# EAGLE schematic STM32F446 front pane - v3 (EAGLE 9.6.2), part 1 of 2

## Sheet 1 of 8
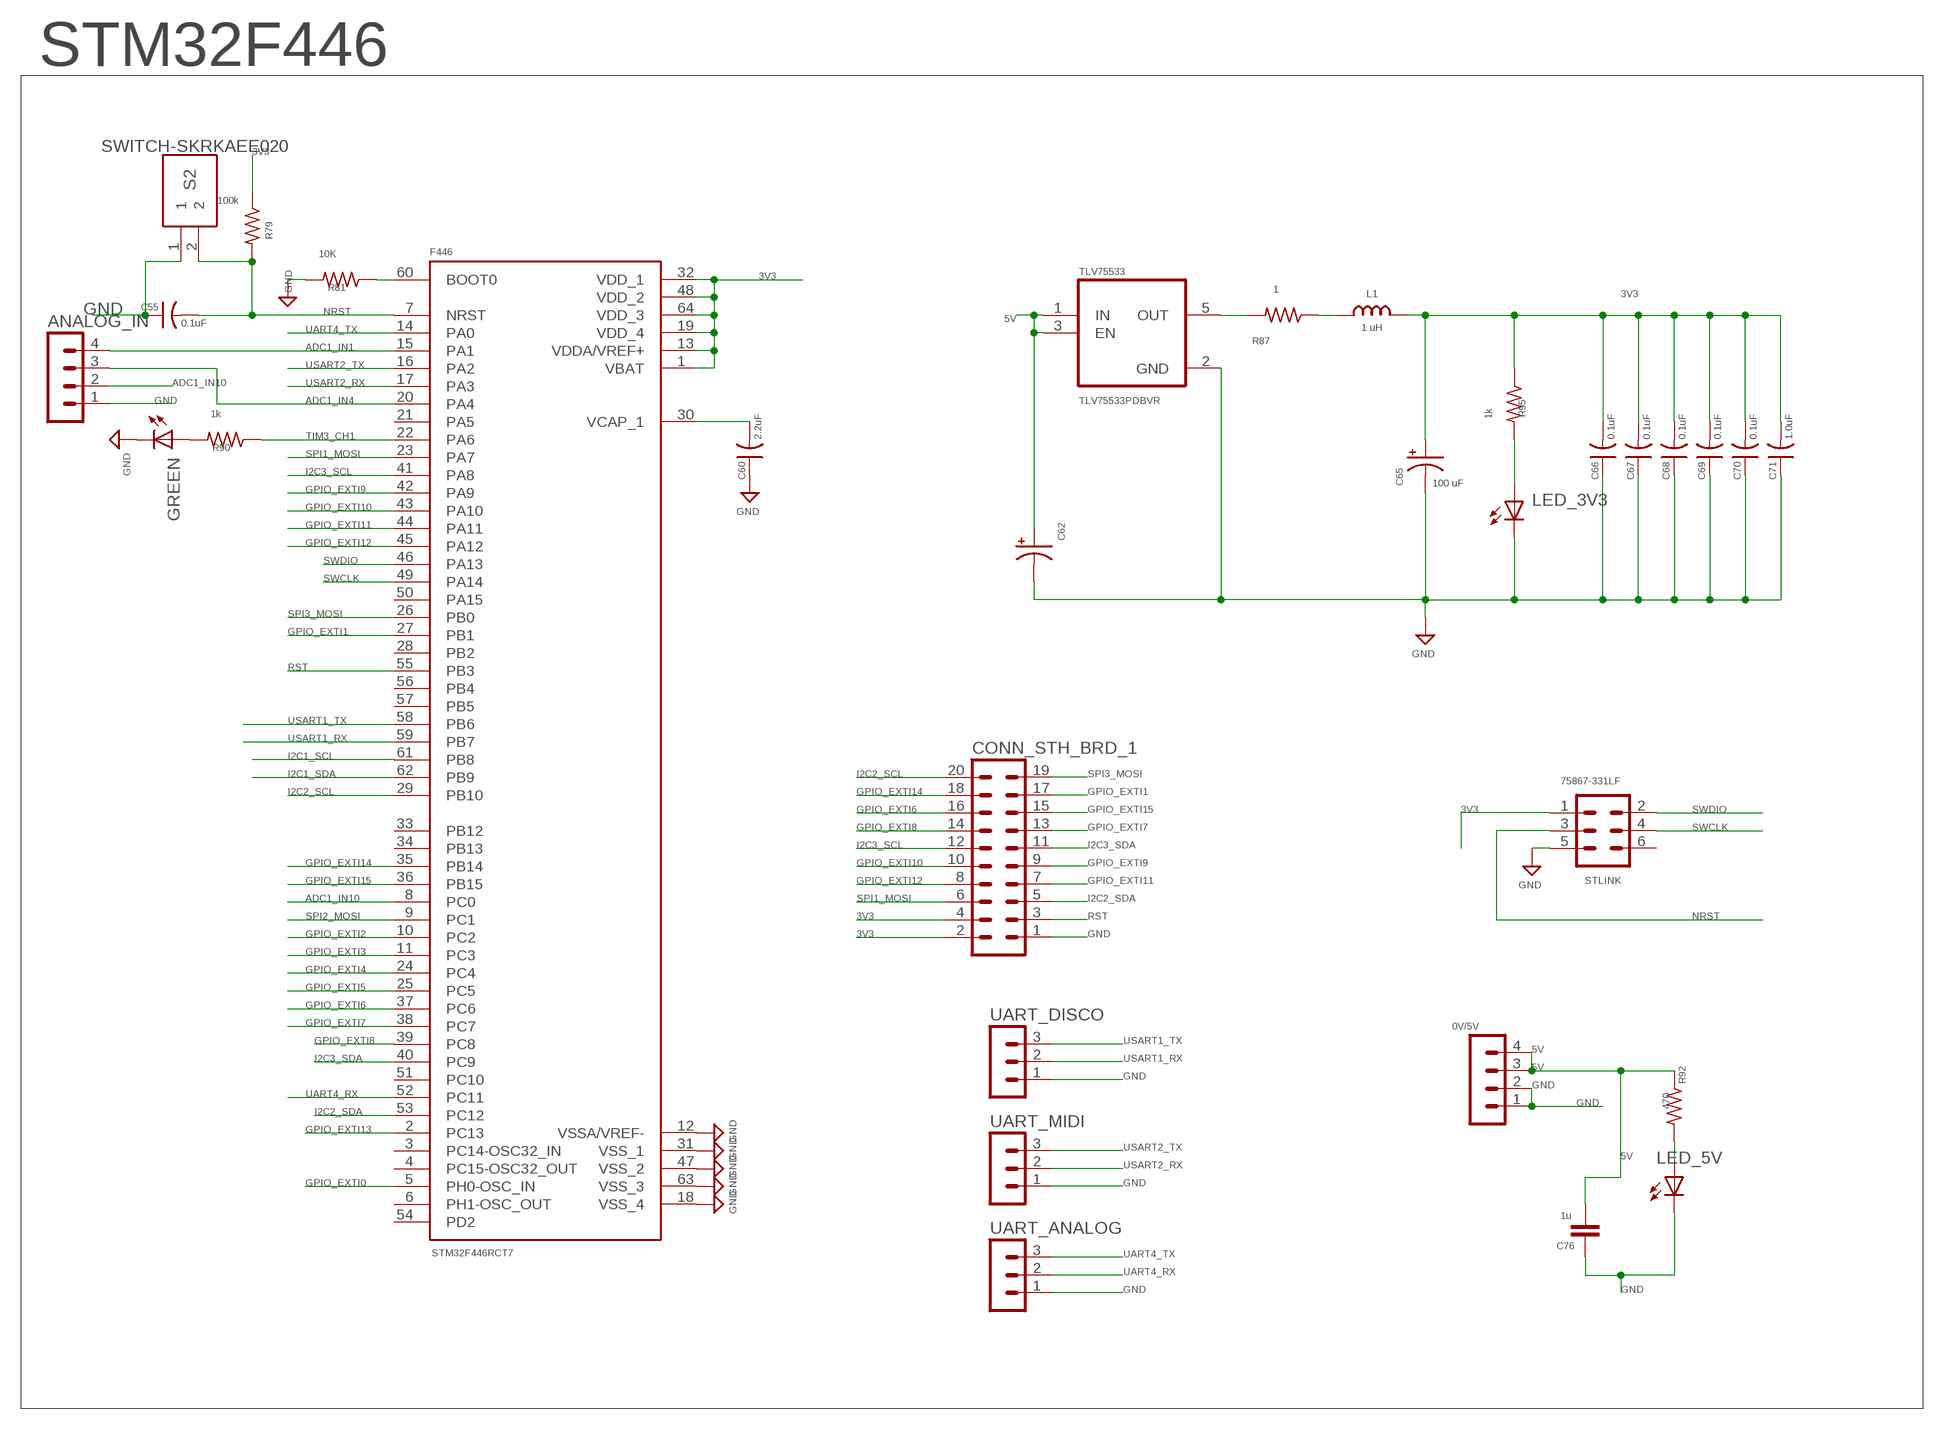
[diagram p0: schematic, sheet 1]

### Parts
0V/5V  PINHEADER-M04PL  [MA04-1]
ANALOG_IN  MA04-1  [MA04-1]
C55  0.1uF  C-US0805  [C0805]
C60  2.2uF  C-US0805  [C0805]
C62  10u  CPOL-US2917  [CPOL2917]
C65  100 uF  CPOL-US2917  [CPOL2917]
C66  0.1uF  C-US0805  [C0805]
C67  0.1uF  C-US0805  [C0805]
C68  0.1uF  C-US0805  [C0805]
C69  0.1uF  C-US0805  [C0805]
C70  0.1uF  C-US0805  [C0805]
C71  1.0uF  C-US0805  [C0805]
C76  1u  C-EUC1206  [C1206]
CONN_STH_BRD_1  MA10-2  [MA10-2]
F446  STM32F446RCT7  [QFP50P1200X1200X160-64N]
GREEN  LED-0805  [0805-LED]
L1  1 uH  L-USL0805  [L0805]
LED_3V3  LED-0805  [0805-LED]
LED_5V  LED-0603  [0603-LED]
R79  100k  R-US0805  [R0805]
R81  10K  R-US0805  [R0805]
R87  1  R-US0805  [R0805]
R90  1k  R-US0805  [R0805]
R92  470  R-US0805  [R0805]
R95  1k  R-US0805  [R0805]
S2  SWITCH-SKRKAEE020  [SKRKAEE020]
STLINK  75867-331LF  MA03-2  [MA03-2]
TLV75533  TLV75533PDBVR  [SOT95P280X145-5N]
UART_ANALOG  MA03-1  [MA03-1]
UART_DISCO  MA03-1  [MA03-1]
UART_MIDI  MA03-1  [MA03-1]

### Nets
3V3: C65.+ C66.2 C67.2 C68.2 C69.2 C70.2 C71.2 CONN_STH_BRD_1.2 CONN_STH_BRD_1.4 F446.1(VBAT) F446.13(VDDA/VREF+) F446.19(VDD_4) F446.32(VDD_1) F446.48(VDD_2) F446.64(VDD_3) L1.2 R79.1 R95.1 STLINK.1 ; also sheet 2,3,4,5,6,7
5V: 0V/5V.3 0V/5V.4 C62.+ C76.2 R92.1 TLV75533.1(IN) TLV75533.3(EN)
ADC1_IN1: ANALOG_IN.4 F446.15(PA1)
ADC1_IN4: ANALOG_IN.3 F446.20(PA4)
ADC1_IN10: ANALOG_IN.2 F446.8(PC0)
BOOT1: F446.60(BOOT0) R81.1
GND: 0V/5V.1 0V/5V.2 ANALOG_IN.1 C55.1 C60.1 C62.- C65.- C66.1 C67.1 C68.1 C69.1 C70.1 C71.1 C76.1 CONN_STH_BRD_1.1 F446.12(VSSA/VREF-) F446.18(VSS_4) F446.31(VSS_1) F446.47(VSS_2) F446.63(VSS_3) GREEN.C LED_3V3.C LED_5V.C R81.2 S2.1 STLINK.5 TLV75533.2(GND) UART_ANALOG.1 UART_DISCO.1 UART_MIDI.1 ; also sheet 2,3,4,5,6,7
GPIO_EXTI0: F446.5(PH0-OSC_IN) ; also sheet 6
GPIO_EXTI1: CONN_STH_BRD_1.17 F446.27(PB1)
GPIO_EXTI2: F446.10(PC2) ; also sheet 6
GPIO_EXTI3: F446.11(PC3) ; also sheet 6
GPIO_EXTI4: F446.24(PC4) ; also sheet 5
GPIO_EXTI5: F446.25(PC5) ; also sheet 5
GPIO_EXTI6: CONN_STH_BRD_1.16 F446.37(PC6)
GPIO_EXTI7: CONN_STH_BRD_1.13 F446.38(PC7)
GPIO_EXTI8: CONN_STH_BRD_1.14 F446.39(PC8)
GPIO_EXTI9: CONN_STH_BRD_1.9 F446.42(PA9)
GPIO_EXTI10: CONN_STH_BRD_1.10 F446.43(PA10)
GPIO_EXTI11: CONN_STH_BRD_1.7 F446.44(PA11)
GPIO_EXTI12: CONN_STH_BRD_1.8 F446.45(PA12)
GPIO_EXTI13: F446.2(PC13) ; also sheet 6
GPIO_EXTI14: CONN_STH_BRD_1.18 F446.35(PB14)
GPIO_EXTI15: CONN_STH_BRD_1.15 F446.36(PB15)
I2C1_SCL: F446.61(PB8) ; also sheet 5,6
I2C1_SDA: F446.62(PB9) ; also sheet 5,6
I2C2_SCL: CONN_STH_BRD_1.20 F446.29(PB10) ; also sheet 2,3,4
I2C2_SDA: CONN_STH_BRD_1.5 F446.53(PC12) ; also sheet 2,3,4
I2C3_SCL: CONN_STH_BRD_1.12 F446.41(PA8) ; also sheet 2
I2C3_SDA: CONN_STH_BRD_1.11 F446.40(PC9) ; also sheet 2
N$53: LED_5V.A R92.2
N$56: GREEN.A R90.2
N$57: LED_3V3.A R95.2
N$108: R87.2 TLV75533.5(OUT)
N$109: L1.1 R87.1
NRST: C55.2 F446.7(NRST) R79.2 S2.2 STLINK.3
RST: CONN_STH_BRD_1.3 F446.55(PB3) ; also sheet 2,3,4,5,6
SPI1_MOSI: CONN_STH_BRD_1.6 F446.23(PA7) ; also sheet 2,3
SPI2_MOSI: F446.9(PC1) ; also sheet 5
SPI3_MOSI: CONN_STH_BRD_1.19 F446.26(PB0) ; also sheet 2,4
SWCLK: F446.49(PA14) STLINK.4
SWDIO: F446.46(PA13) STLINK.2
TIM3_CH1: F446.22(PA6) R90.1
UART4_RX: F446.52(PC11) UART_ANALOG.2
UART4_TX: F446.14(PA0) UART_ANALOG.3
USART1_RX: F446.59(PB7) UART_DISCO.2
USART1_TX: F446.58(PB6) UART_DISCO.3
USART2_RX: F446.17(PA3) UART_MIDI.2
USART2_TX: F446.16(PA2) UART_MIDI.3
VCAP1: C60.2 F446.30(VCAP_1)
Unconnected: F446.3(PC14-OSC32_IN) F446.4(PC15-OSC32_OUT) F446.6(PH1-OSC_OUT) F446.21(PA5) F446.28(PB2) F446.33(PB12) F446.34(PB13) F446.50(PA15) F446.51(PC10) F446.54(PD2) F446.56(PB4) F446.57(PB5) STLINK.6

### Notes on the sheet
- STM32F446

## Sheet 2 of 8
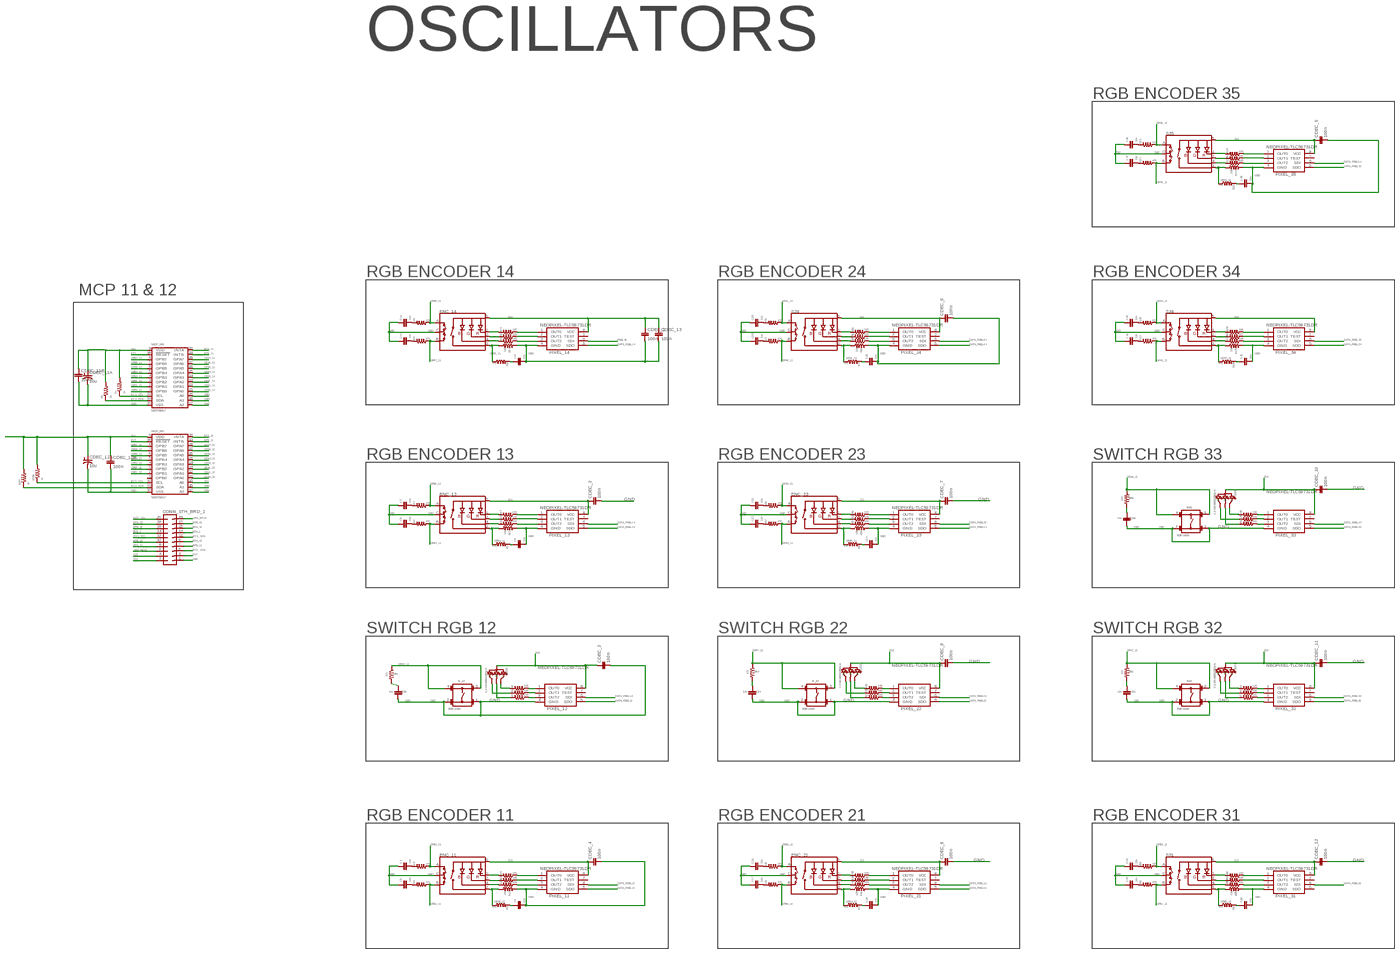
[diagram p1: schematic, sheet 2, overview]
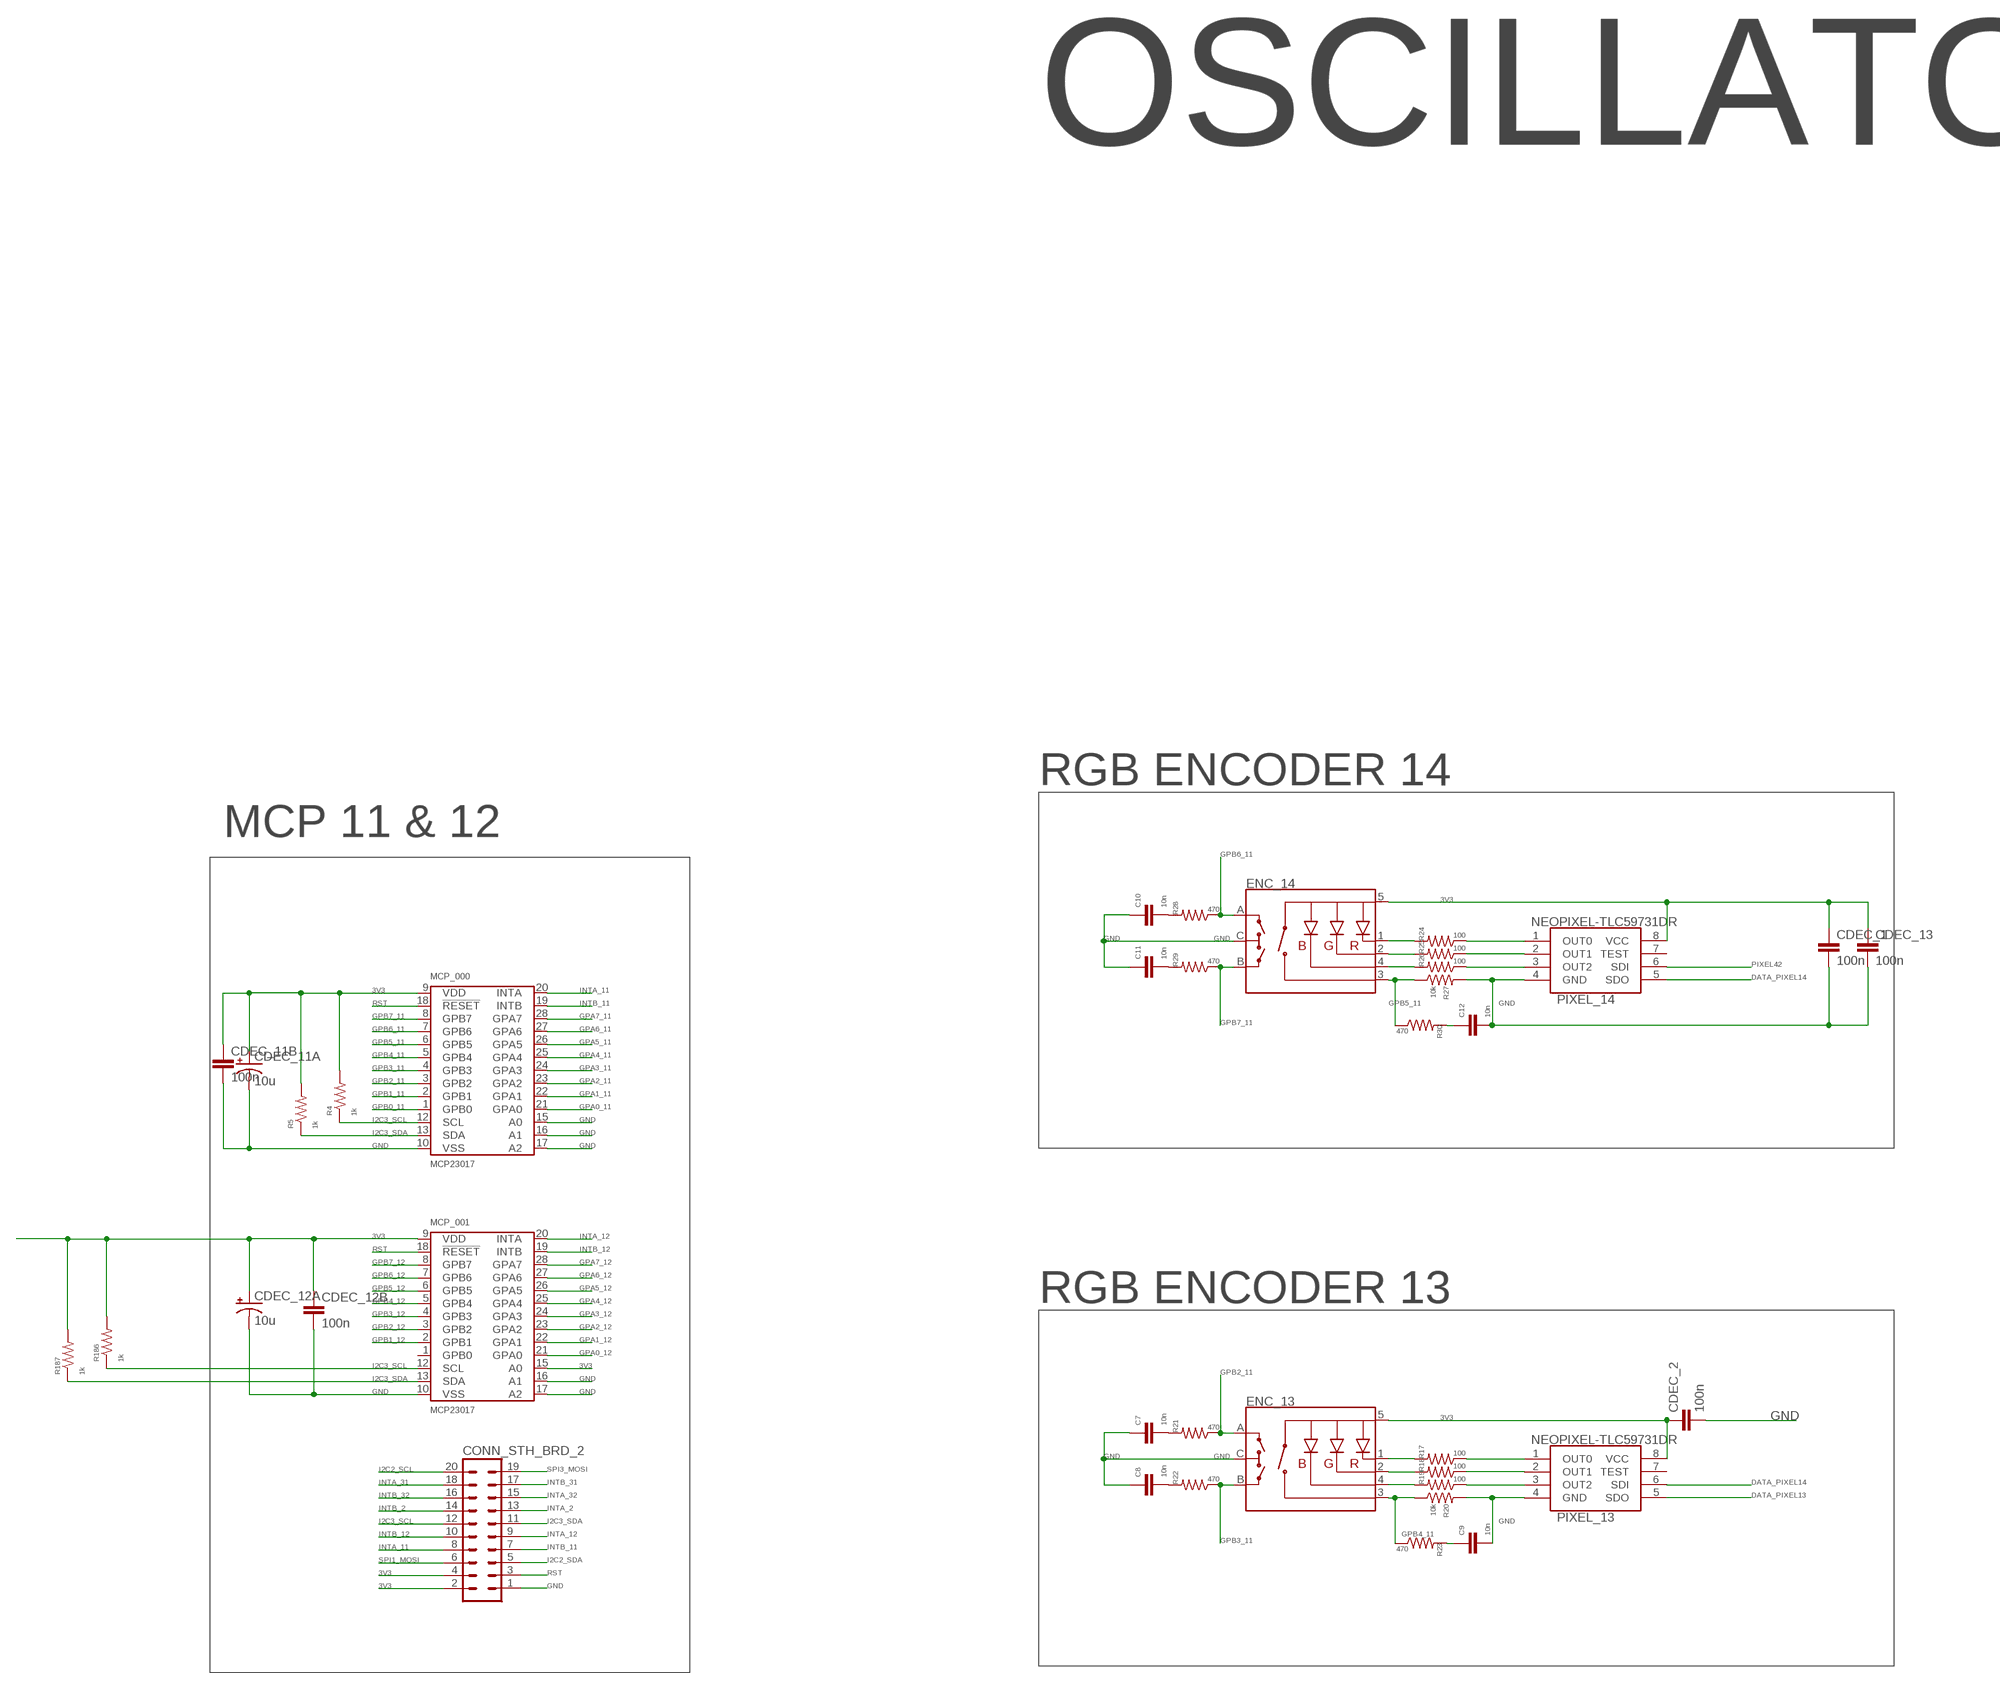
[diagram p2: schematic, sheet 2, part 1 of 4]
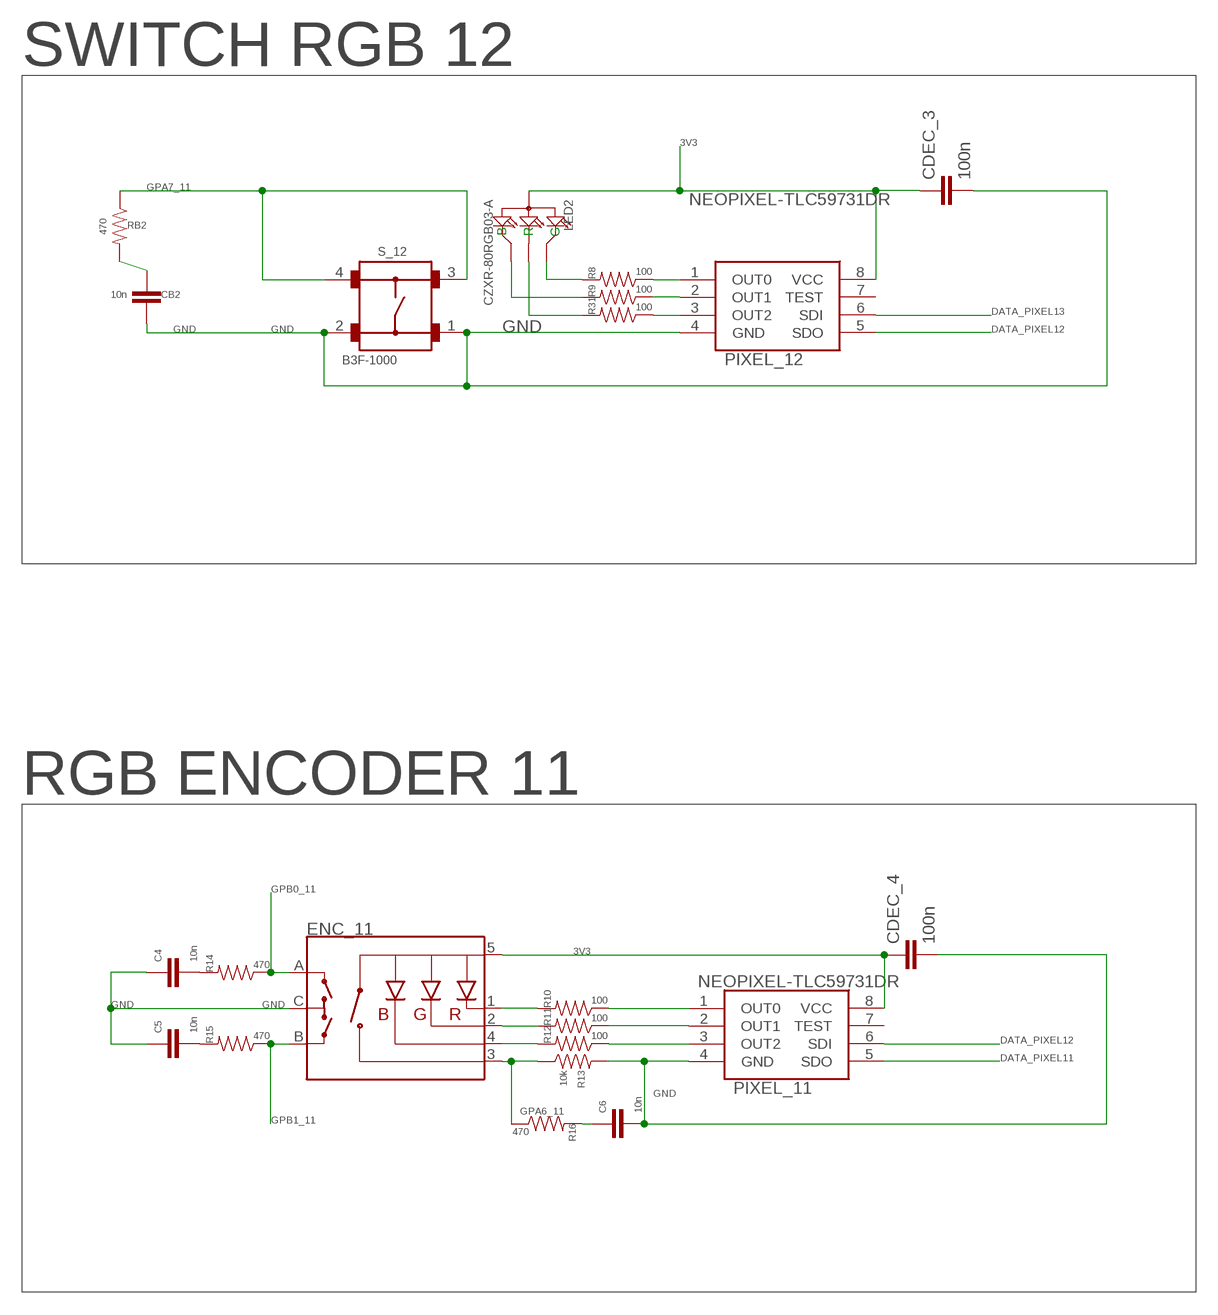
[diagram p3: schematic, sheet 2, part 2 of 4]
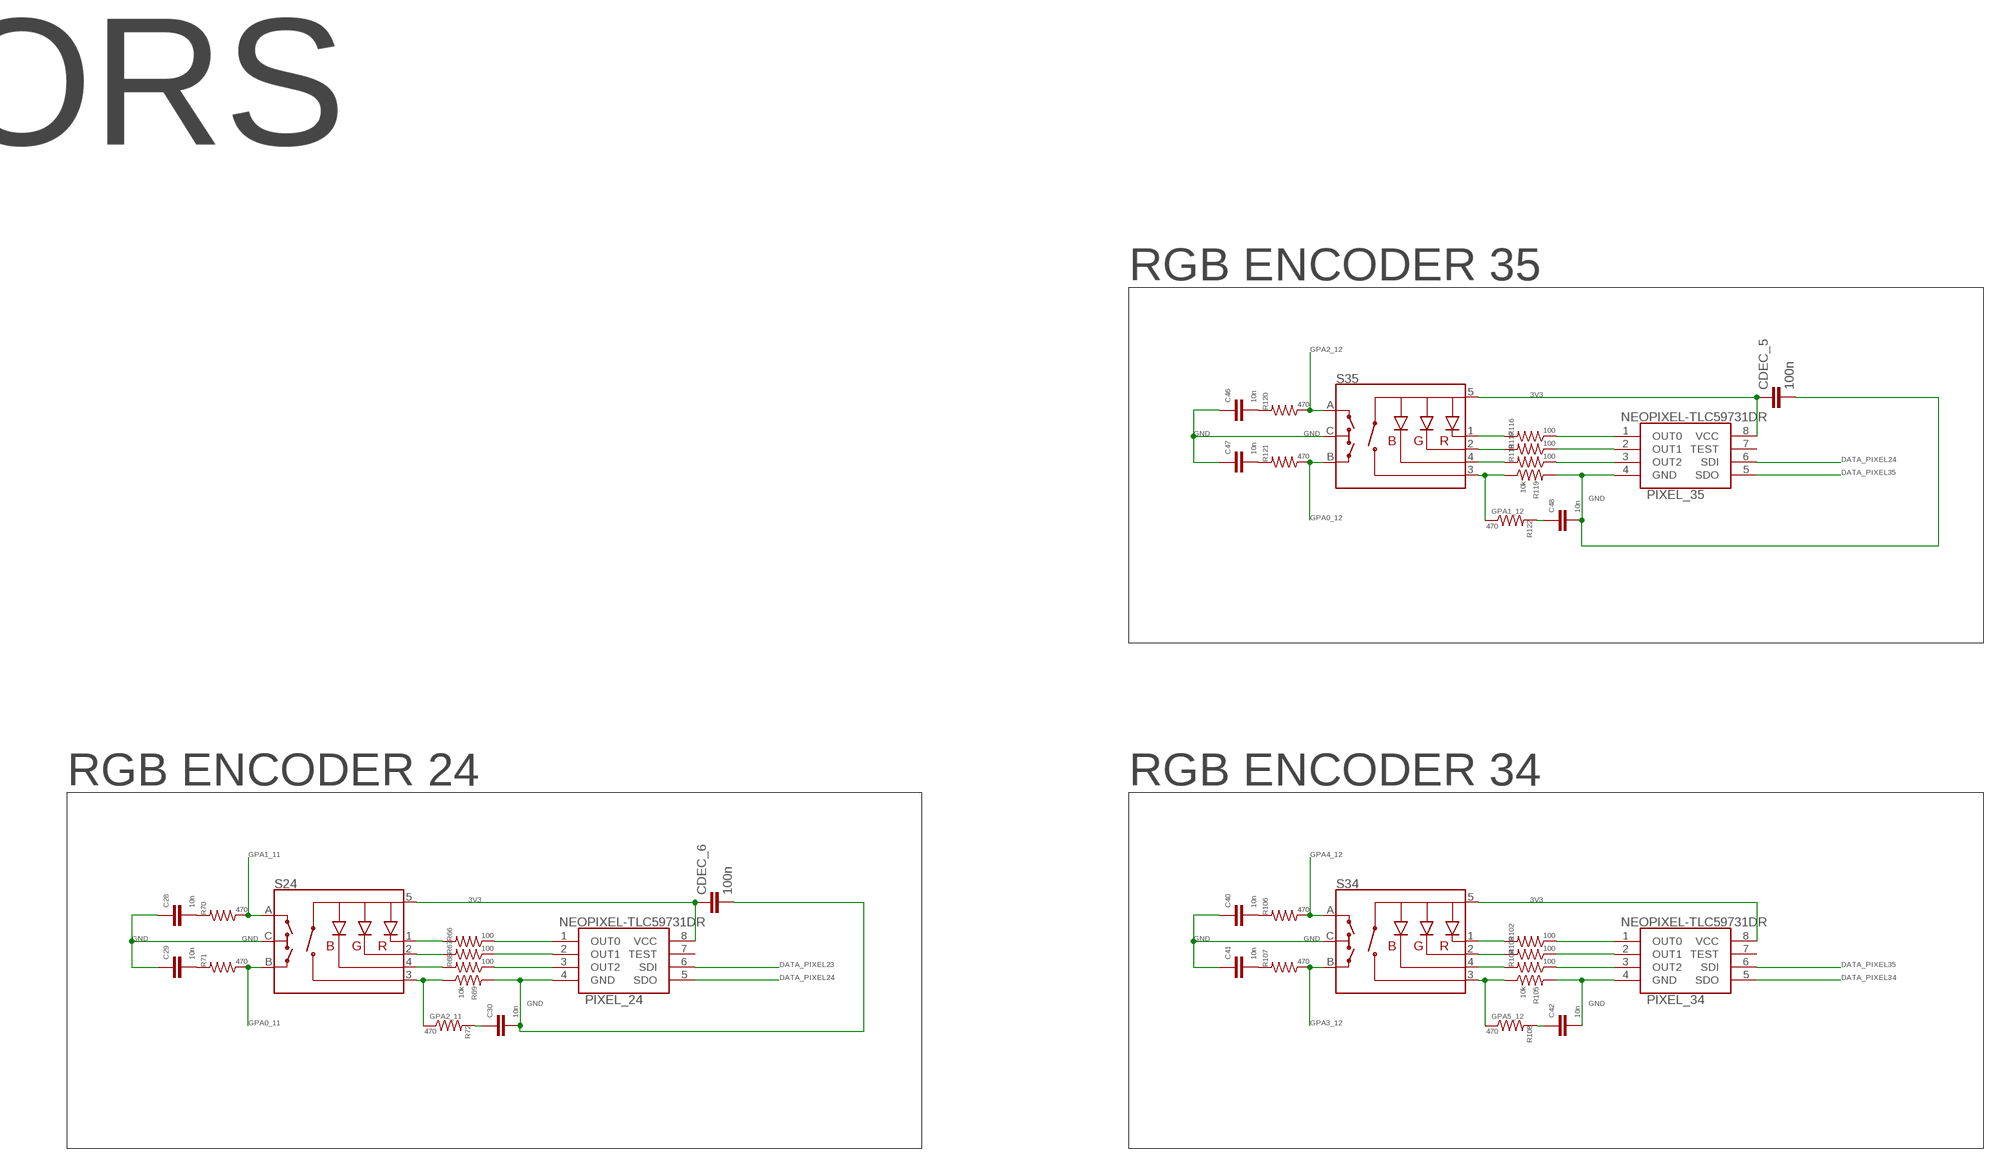
[diagram p4: schematic, sheet 2, part 3 of 4]
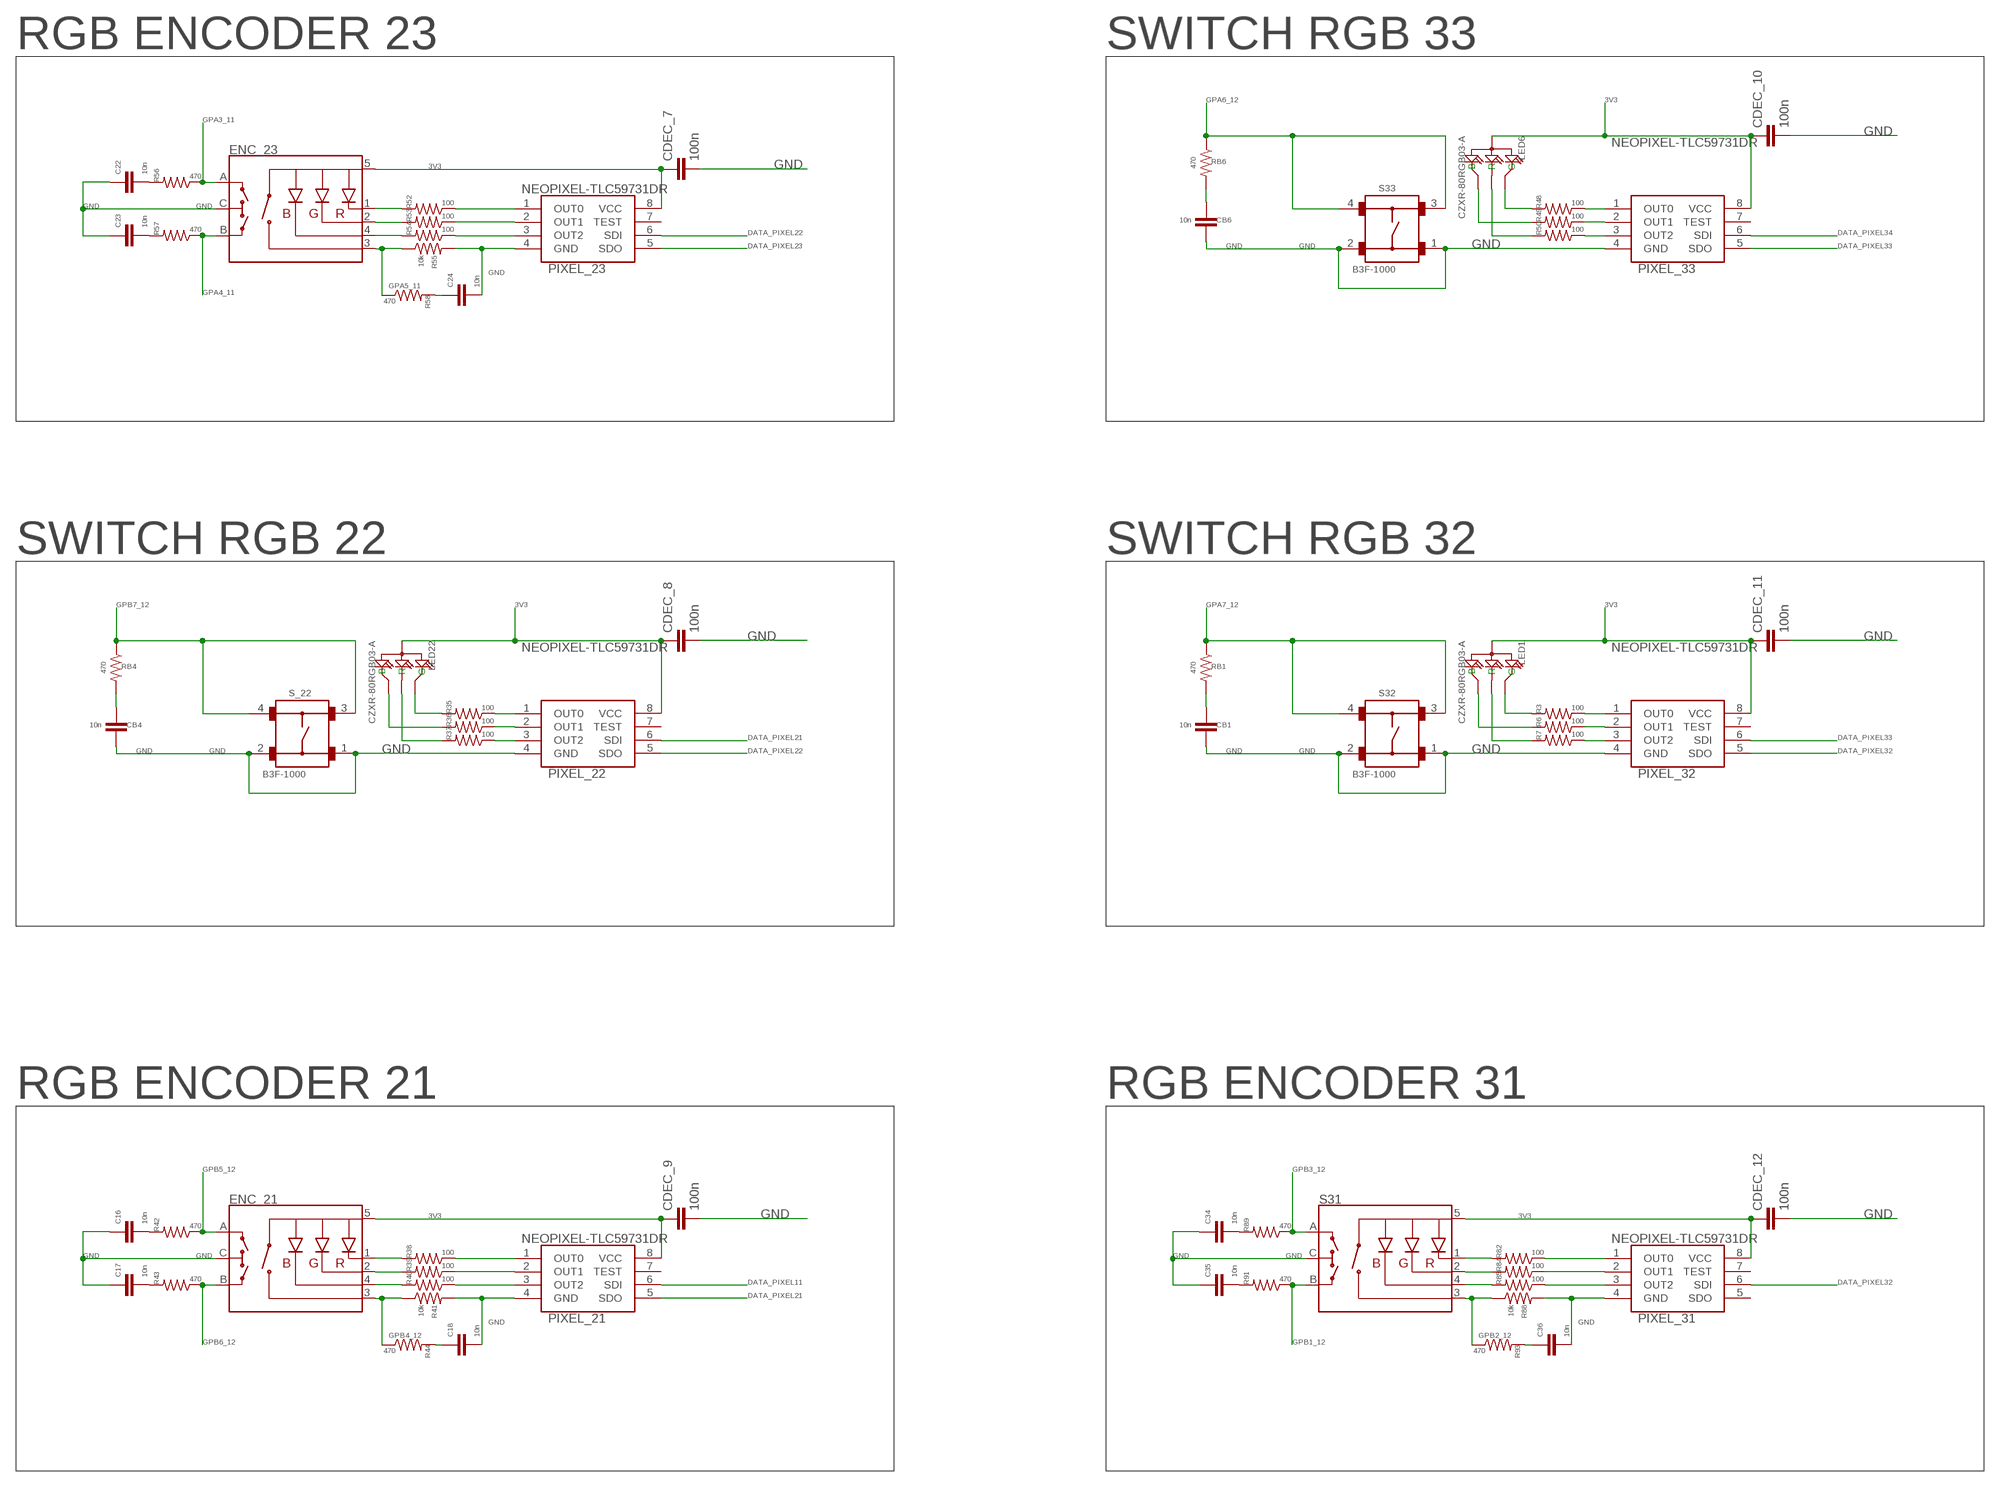
[diagram p5: schematic, sheet 2, part 4 of 4]

### Parts
C4  10n  PASSIF-CAP-0805  [0805-CAP]
C5  10n  PASSIF-CAP-0805  [0805-CAP]
C6  10n  PASSIF-CAP-0805  [0805-CAP]
C7  10n  PASSIF-CAP-0805  [0805-CAP]
C8  10n  PASSIF-CAP-0805  [0805-CAP]
C9  10n  PASSIF-CAP-0805  [0805-CAP]
C10  10n  PASSIF-CAP-0805  [0805-CAP]
C11  10n  PASSIF-CAP-0805  [0805-CAP]
C12  10n  PASSIF-CAP-0805  [0805-CAP]
C16  10n  PASSIF-CAP-0805  [0805-CAP]
C17  10n  PASSIF-CAP-0805  [0805-CAP]
C18  10n  PASSIF-CAP-0805  [0805-CAP]
C22  10n  PASSIF-CAP-0805  [0805-CAP]
C23  10n  PASSIF-CAP-0805  [0805-CAP]
C24  10n  PASSIF-CAP-0805  [0805-CAP]
C28  10n  PASSIF-CAP-0805  [0805-CAP]
C29  10n  PASSIF-CAP-0805  [0805-CAP]
C30  10n  PASSIF-CAP-0805  [0805-CAP]
C34  10n  PASSIF-CAP-0805  [0805-CAP]
C35  10n  PASSIF-CAP-0805  [0805-CAP]
C36  10n  PASSIF-CAP-0805  [0805-CAP]
C40  10n  PASSIF-CAP-0805  [0805-CAP]
C41  10n  PASSIF-CAP-0805  [0805-CAP]
C42  10n  PASSIF-CAP-0805  [0805-CAP]
C46  10n  PASSIF-CAP-0805  [0805-CAP]
C47  10n  PASSIF-CAP-0805  [0805-CAP]
C48  10n  PASSIF-CAP-0805  [0805-CAP]
CB1  10n  PASSIF-CAP-0805  [0805-CAP]
CB2  10n  PASSIF-CAP-0805  [0805-CAP]
CB4  10n  PASSIF-CAP-0805  [0805-CAP]
CB6  10n  PASSIF-CAP-0805  [0805-CAP]
CDEC_1  100n  PASSIF-CAP-1206  [1206]
CDEC_2  100n  PASSIF-CAP-1206  [1206]
CDEC_3  100n  PASSIF-CAP-1206  [1206]
CDEC_4  100n  PASSIF-CAP-1206  [1206]
CDEC_5  100n  PASSIF-CAP-1206  [1206]
CDEC_6  100n  PASSIF-CAP-1206  [1206]
CDEC_7  100n  PASSIF-CAP-1206  [1206]
CDEC_8  100n  PASSIF-CAP-1206  [1206]
CDEC_9  100n  PASSIF-CAP-1206  [1206]
CDEC_10  100n  PASSIF-CAP-1206  [1206]
CDEC_11  100n  PASSIF-CAP-1206  [1206]
CDEC_11A  10u  PASSIF-CPOL-US2917  [CPOL2917]
CDEC_11B  100n  PASSIF-CAP-0805  [0805-CAP]
CDEC_12  100n  PASSIF-CAP-1206  [1206]
CDEC_12A  10u  PASSIF-CPOL-US2917  [CPOL2917]
CDEC_12B  100n  PASSIF-CAP-0805  [0805-CAP]
CDEC_13  100n  PASSIF-CAP-1206  [1206]
CONN_STH_BRD_2  MA10-2  [MA10-2]
ENC_11  ENCODER-RGB-SWITCH-NO_NUT  [ENCODER_LED_3]
ENC_13  ENCODER-RGB-SWITCH-NO_NUT  [ENCODER_LED_3]
ENC_14  ENCODER-RGB-SWITCH-NO_NUT  [ENCODER_LED_3]
ENC_21  ENCODER-RGB-SWITCH-NO_NUT  [ENCODER_LED_3]
ENC_23  ENCODER-RGB-SWITCH-NO_NUT  [ENCODER_LED_3]
LED1  CZXR-80RGB03-A  DIP-LED-RGB-COMMON-ANODE(4P-D8MM)  [LED4-2.0-D8.0MM]
LED2  CZXR-80RGB03-A  DIP-LED-RGB-COMMON-ANODE(4P-D8MM)  [LED4-2.0-D8.0MM]
LED6  CZXR-80RGB03-A  DIP-LED-RGB-COMMON-ANODE(4P-D8MM)  [LED4-2.0-D8.0MM]
LED22  CZXR-80RGB03-A  DIP-LED-RGB-COMMON-ANODE(4P-D8MM)  [LED4-2.0-D8.0MM]
MCP_000  MCP23017  [SOIC-28]
MCP_001  MCP23017  [SOIC-28]
PIXEL_11  NEOPIXEL-TLC59731DR  [SOIC127P600X175-8N]
PIXEL_12  NEOPIXEL-TLC59731DR  [SOIC127P600X175-8N]
PIXEL_13  NEOPIXEL-TLC59731DR  [SOIC127P600X175-8N]
PIXEL_14  NEOPIXEL-TLC59731DR  [SOIC127P600X175-8N]
PIXEL_21  NEOPIXEL-TLC59731DR  [SOIC127P600X175-8N]
PIXEL_22  NEOPIXEL-TLC59731DR  [SOIC127P600X175-8N]
PIXEL_23  NEOPIXEL-TLC59731DR  [SOIC127P600X175-8N]
PIXEL_24  NEOPIXEL-TLC59731DR  [SOIC127P600X175-8N]
PIXEL_31  NEOPIXEL-TLC59731DR  [SOIC127P600X175-8N]
PIXEL_32  NEOPIXEL-TLC59731DR  [SOIC127P600X175-8N]
PIXEL_33  NEOPIXEL-TLC59731DR  [SOIC127P600X175-8N]
PIXEL_34  NEOPIXEL-TLC59731DR  [SOIC127P600X175-8N]
PIXEL_35  NEOPIXEL-TLC59731DR  [SOIC127P600X175-8N]
R3  100  PASSIF-RESISTOR-1206  [1206]
R4  1k  R-US_R0805  [R0805]
R5  1k  R-US_R0805  [R0805]
R6  100  PASSIF-RESISTOR-1206  [1206]
R7  100  PASSIF-RESISTOR-1206  [1206]
R8  100  PASSIF-RESISTOR-1206  [1206]
R9  100  PASSIF-RESISTOR-1206  [1206]
R10  100  PASSIF-RESISTOR-1206  [1206]
R11  100  PASSIF-RESISTOR-1206  [1206]
R12  100  PASSIF-RESISTOR-1206  [1206]
R13  10k  PASSIF-RESISTOR-1206  [1206]
R14  470  PASSIF-RESISTOR-1206  [1206]
R15  470  PASSIF-RESISTOR-1206  [1206]
R16  470  PASSIF-RESISTOR-1206  [1206]
R17  100  PASSIF-RESISTOR-1206  [1206]
R18  100  PASSIF-RESISTOR-1206  [1206]
R19  100  PASSIF-RESISTOR-1206  [1206]
R20  10k  PASSIF-RESISTOR-1206  [1206]
R21  470  PASSIF-RESISTOR-1206  [1206]
R22  470  PASSIF-RESISTOR-1206  [1206]
R23  470  PASSIF-RESISTOR-1206  [1206]
R24  100  PASSIF-RESISTOR-1206  [1206]
R25  100  PASSIF-RESISTOR-1206  [1206]
R26  100  PASSIF-RESISTOR-1206  [1206]
R27  10k  PASSIF-RESISTOR-1206  [1206]
R28  470  PASSIF-RESISTOR-1206  [1206]
R29  470  PASSIF-RESISTOR-1206  [1206]
R30  470  PASSIF-RESISTOR-1206  [1206]
R31  100  PASSIF-RESISTOR-1206  [1206]
R35  100  PASSIF-RESISTOR-1206  [1206]
R36  100  PASSIF-RESISTOR-1206  [1206]
R37  100  PASSIF-RESISTOR-1206  [1206]
R38  100  PASSIF-RESISTOR-1206  [1206]
R39  100  PASSIF-RESISTOR-1206  [1206]
R40  100  PASSIF-RESISTOR-1206  [1206]
R41  10k  PASSIF-RESISTOR-1206  [1206]
R42  470  PASSIF-RESISTOR-1206  [1206]
R43  470  PASSIF-RESISTOR-1206  [1206]
R44  470  PASSIF-RESISTOR-1206  [1206]
R48  100  PASSIF-RESISTOR-1206  [1206]
R49  100  PASSIF-RESISTOR-1206  [1206]
R50  100  PASSIF-RESISTOR-1206  [1206]
R52  100  PASSIF-RESISTOR-1206  [1206]
R53  100  PASSIF-RESISTOR-1206  [1206]
R54  100  PASSIF-RESISTOR-1206  [1206]
R55  10k  PASSIF-RESISTOR-1206  [1206]
R56  470  PASSIF-RESISTOR-1206  [1206]
R57  470  PASSIF-RESISTOR-1206  [1206]
R58  470  PASSIF-RESISTOR-1206  [1206]
R66  100  PASSIF-RESISTOR-1206  [1206]
R67  100  PASSIF-RESISTOR-1206  [1206]
R68  100  PASSIF-RESISTOR-1206  [1206]
R69  10k  PASSIF-RESISTOR-1206  [1206]
R70  470  PASSIF-RESISTOR-1206  [1206]
R71  470  PASSIF-RESISTOR-1206  [1206]
R72  470  PASSIF-RESISTOR-1206  [1206]
R82  100  PASSIF-RESISTOR-1206  [1206]
R84  100  PASSIF-RESISTOR-1206  [1206]
R85  100  PASSIF-RESISTOR-1206  [1206]
R88  10k  PASSIF-RESISTOR-1206  [1206]
R89  470  PASSIF-RESISTOR-1206  [1206]
R91  470  PASSIF-RESISTOR-1206  [1206]
R93  470  PASSIF-RESISTOR-1206  [1206]
R102  100  PASSIF-RESISTOR-1206  [1206]
R103  100  PASSIF-RESISTOR-1206  [1206]
R104  100  PASSIF-RESISTOR-1206  [1206]
R105  10k  PASSIF-RESISTOR-1206  [1206]
R106  470  PASSIF-RESISTOR-1206  [1206]
R107  470  PASSIF-RESISTOR-1206  [1206]
R108  470  PASSIF-RESISTOR-1206  [1206]
R116  100  PASSIF-RESISTOR-1206  [1206]
R117  100  PASSIF-RESISTOR-1206  [1206]
R118  100  PASSIF-RESISTOR-1206  [1206]
R119  10k  PASSIF-RESISTOR-1206  [1206]
R120  470  PASSIF-RESISTOR-1206  [1206]
R121  470  PASSIF-RESISTOR-1206  [1206]
R122  470  PASSIF-RESISTOR-1206  [1206]
R186  1k  R-US_R0805  [R0805]
R187  1k  R-US_R0805  [R0805]
RB1  470  PASSIF-RESISTOR-1206  [1206]
RB2  470  PASSIF-RESISTOR-1206  [1206]
RB4  470  PASSIF-RESISTOR-1206  [1206]
RB6  470  PASSIF-RESISTOR-1206  [1206]
S24  ENCODER-RGB-SWITCH-NO_NUT  [ENCODER_LED_3]
S31  ENCODER-RGB-SWITCH-NO_NUT  [ENCODER_LED_3]
S32  B3F-1000  [B3F-1000]
S33  B3F-1000  [B3F-1000]
S34  ENCODER-RGB-SWITCH-NO_NUT  [ENCODER_LED_3]
S35  ENCODER-RGB-SWITCH-NO_NUT  [ENCODER_LED_3]
S_12  B3F-1000  [B3F-1000]
S_22  B3F-1000  [B3F-1000]

### Nets
3V3: CDEC_1.1 CDEC_2.1 CDEC_3.1 CDEC_4.1 CDEC_5.1 CDEC_6.1 CDEC_7.1 CDEC_8.1 CDEC_9.1 CDEC_10.1 CDEC_11.1 CDEC_11A.+ CDEC_11B.1 CDEC_12.1 CDEC_12A.+ CDEC_12B.1 CDEC_13.1 CONN_STH_BRD_2.2 CONN_STH_BRD_2.4 ENC_11.5(+) ENC_13.5(+) ENC_14.5(+) ENC_21.5(+) ENC_23.5(+) LED1.2(+) LED2.2(+) LED6.2(+) LED22.2(+) MCP_000.9(VDD) MCP_001.9(VDD) MCP_001.15(A0) PIXEL_11.8(VCC) PIXEL_12.8(VCC) PIXEL_13.8(VCC) PIXEL_14.8(VCC) PIXEL_21.8(VCC) PIXEL_22.8(VCC) PIXEL_23.8(VCC) PIXEL_24.8(VCC) PIXEL_31.8(VCC) PIXEL_32.8(VCC) PIXEL_33.8(VCC) PIXEL_34.8(VCC) PIXEL_35.8(VCC) R4.2 R5.2 R186.2 R187.2 S24.5(+) S31.5(+) S34.5(+) S35.5(+) ; also sheet 1,3,4,5,6,7
DATA_PIXEL11: PIXEL_11.5(SDO) PIXEL_21.6(SDI)
DATA_PIXEL12: PIXEL_11.6(SDI) PIXEL_12.5(SDO)
DATA_PIXEL13: PIXEL_12.6(SDI) PIXEL_13.5(SDO)
DATA_PIXEL14: PIXEL_13.6(SDI) PIXEL_14.5(SDO)
DATA_PIXEL21: PIXEL_21.5(SDO) PIXEL_22.6(SDI)
DATA_PIXEL22: PIXEL_22.5(SDO) PIXEL_23.6(SDI)
DATA_PIXEL23: PIXEL_23.5(SDO) PIXEL_24.6(SDI)
DATA_PIXEL24: PIXEL_24.5(SDO) PIXEL_35.6(SDI)
DATA_PIXEL32: PIXEL_31.6(SDI) PIXEL_32.5(SDO)
DATA_PIXEL33: PIXEL_32.6(SDI) PIXEL_33.5(SDO)
DATA_PIXEL34: PIXEL_33.6(SDI) PIXEL_34.5(SDO)
DATA_PIXEL35: PIXEL_34.6(SDI) PIXEL_35.5(SDO)
GND: C4.1 C5.1 C6.2 C7.1 C8.1 C9.2 C10.1 C11.1 C12.2 C16.1 C17.1 C18.2 C22.1 C23.1 C24.2 C28.1 C29.1 C30.2 C34.1 C35.1 C36.2 C40.1 C41.1 C42.2 C46.1 C47.1 C48.2 CB1.1 CB2.1 CB4.1 CB6.1 CDEC_1.2 CDEC_2.2 CDEC_3.2 CDEC_4.2 CDEC_5.2 CDEC_6.2 CDEC_7.2 CDEC_8.2 CDEC_9.2 CDEC_10.2 CDEC_11.2 CDEC_11A.- CDEC_11B.2 CDEC_12.2 CDEC_12A.- CDEC_12B.2 CDEC_13.2 CONN_STH_BRD_2.1 ENC_11.C ENC_13.C ENC_14.C ENC_21.C ENC_23.C MCP_000.10(VSS) MCP_000.15(A0) MCP_000.16(A1) MCP_000.17(A2) MCP_001.10(VSS) MCP_001.16(A1) MCP_001.17(A2) PIXEL_11.4(GND) PIXEL_12.4(GND) PIXEL_13.4(GND) PIXEL_14.4(GND) PIXEL_21.4(GND) PIXEL_22.4(GND) PIXEL_23.4(GND) PIXEL_24.4(GND) PIXEL_31.4(GND) PIXEL_32.4(GND) PIXEL_33.4(GND) PIXEL_34.4(GND) PIXEL_35.4(GND) R13.2 R20.2 R27.2 R41.2 R55.2 R69.2 R88.2 R105.2 R119.2 S24.C S31.C S32.1 S32.2 S33.1 S33.2 S34.C S35.C S_12.1 S_12.2 S_22.1 S_22.2 ; also sheet 1,3,4,5,6,7
GPA0_11: MCP_000.21(GPA0) R71.1 S24.B
GPA0_12: MCP_001.21(GPA0) R121.1 S35.B
GPA1_11: MCP_000.22(GPA1) R70.1 S24.A
GPA1_12: MCP_001.22(GPA1) R119.1 R122.1 S35.3(SW)
GPA2_11: MCP_000.23(GPA2) R69.1 R72.1 S24.3(SW)
GPA2_12: MCP_001.23(GPA2) R120.1 S35.A
GPA3_11: ENC_23.A MCP_000.24(GPA3) R56.1
GPA3_12: MCP_001.24(GPA3) R107.1 S34.B
GPA4_11: ENC_23.B MCP_000.25(GPA4) R57.1
GPA4_12: MCP_001.25(GPA4) R106.1 S34.A
GPA5_11: ENC_23.3(SW) MCP_000.26(GPA5) R55.1 R58.1
GPA5_12: MCP_001.26(GPA5) R105.1 R108.1 S34.3(SW)
GPA6_11: ENC_11.3(SW) MCP_000.27(GPA6) R13.1 R16.1
GPA6_12: MCP_001.27(GPA6) RB6.1 S33.3 S33.4
GPA7_11: MCP_000.28(GPA7) RB2.1 S_12.3 S_12.4
GPA7_12: MCP_001.28(GPA7) RB1.1 S32.3 S32.4
GPB0_11: ENC_11.A MCP_000.1(GPB0) R14.1
GPB1_11: ENC_11.B MCP_000.2(GPB1) R15.1
GPB1_12: MCP_001.2(GPB1) R91.1 S31.B
GPB2_11: ENC_13.A MCP_000.3(GPB2) R21.1
GPB2_12: MCP_001.3(GPB2) R88.1 R93.1 S31.3(SW)
GPB3_11: ENC_13.B MCP_000.4(GPB3) R22.1
GPB3_12: MCP_001.4(GPB3) R89.1 S31.A
GPB4_11: ENC_13.3(SW) MCP_000.5(GPB4) R20.1 R23.1
GPB4_12: ENC_21.3(SW) MCP_001.5(GPB4) R41.1 R44.1
GPB5_11: ENC_14.3(SW) MCP_000.6(GPB5) R27.1 R30.1
GPB5_12: ENC_21.A MCP_001.6(GPB5) R42.1
GPB6_11: ENC_14.A MCP_000.7(GPB6) R28.1
GPB6_12: ENC_21.B MCP_001.7(GPB6) R43.1
GPB7_11: ENC_14.B MCP_000.8(GPB7) R29.1
GPB7_12: MCP_001.8(GPB7) RB4.1 S_22.3 S_22.4
I2C2_SCL: CONN_STH_BRD_2.20 ; also sheet 1,3,4
I2C2_SDA: CONN_STH_BRD_2.5 ; also sheet 1,3,4
I2C3_SCL: CONN_STH_BRD_2.12 MCP_000.12(SCL) MCP_001.12(SCL) R4.1 R186.1 ; also sheet 1
I2C3_SDA: CONN_STH_BRD_2.11 MCP_000.13(SDA) MCP_001.13(SDA) R5.1 R187.1 ; also sheet 1
INTA_2: CONN_STH_BRD_2.13 ; also sheet 3
INTA_11: CONN_STH_BRD_2.8 MCP_000.20(INTA)
INTA_12: CONN_STH_BRD_2.9 MCP_001.20(INTA)
INTA_31: CONN_STH_BRD_2.18 ; also sheet 4
INTA_32: CONN_STH_BRD_2.15 ; also sheet 4
INTB_2: CONN_STH_BRD_2.14 ; also sheet 3
INTB_11: CONN_STH_BRD_2.7 MCP_000.19(INTB)
INTB_12: CONN_STH_BRD_2.10 MCP_001.19(INTB)
INTB_31: CONN_STH_BRD_2.17 ; also sheet 4
INTB_32: CONN_STH_BRD_2.16 ; also sheet 4
N$710: PIXEL_32.1(OUT0) R3.1
N$711: PIXEL_32.2(OUT1) R6.1
N$712: ENC_11.1(-R) R10.2
N$713: ENC_11.2(-G) R11.2
N$714: ENC_11.4(-B) R12.2
N$715: PIXEL_11.1(OUT0) R10.1
N$716: PIXEL_11.2(OUT1) R11.1
N$717: PIXEL_11.3(OUT2) R12.1
N$718: C4.2 R14.2
N$719: C5.2 R15.2
N$720: C6.1 R16.2
N$1069: ENC_13.1(-R) R17.2
N$1070: ENC_13.2(-G) R18.2
N$1071: ENC_13.4(-B) R19.2
N$1072: PIXEL_13.1(OUT0) R17.1
N$1073: PIXEL_13.2(OUT1) R18.1
N$1074: PIXEL_13.3(OUT2) R19.1
N$1075: C7.2 R21.2
N$1076: C8.2 R22.2
N$1077: C9.1 R23.2
N$1252: ENC_14.1(-R) R24.2
N$1253: ENC_14.2(-G) R25.2
N$1254: ENC_14.4(-B) R26.2
N$1255: PIXEL_14.1(OUT0) R24.1
N$1256: PIXEL_14.2(OUT1) R25.1
N$1257: PIXEL_14.3(OUT2) R26.1
N$1258: C10.2 R28.2
N$1259: C11.2 R29.2
N$1260: C12.1 R30.2
N$1435: PIXEL_32.3(OUT2) R7.1
N$1436: CB1.2 RB1.2
N$1437: LED1.1(R) R7.2
N$1438: LED1.4(B) R6.2
N$1439: LED1.3(G) R3.2
N$1614: PIXEL_12.1(OUT0) R8.1
N$1615: PIXEL_12.2(OUT1) R9.1
N$1616: PIXEL_12.3(OUT2) R31.1
N$1617: CB2.2 RB2.2
N$1618: ENC_21.1(-R) R38.2
N$1619: ENC_21.2(-G) R39.2
N$1620: ENC_21.4(-B) R40.2
N$1621: PIXEL_21.1(OUT0) R38.1
N$1622: PIXEL_21.2(OUT1) R39.1
N$1623: PIXEL_21.3(OUT2) R40.1
N$1624: C16.2 R42.2
N$1625: C17.2 R43.2
N$1626: C18.1 R44.2
N$1801: LED2.1(R) R31.2
N$1802: LED2.4(B) R9.2
N$1803: LED2.3(G) R8.2
N$1984: ENC_23.1(-R) R52.2
N$1985: ENC_23.2(-G) R53.2
N$1986: ENC_23.4(-B) R54.2
N$1987: PIXEL_23.1(OUT0) R52.1
N$1988: PIXEL_23.2(OUT1) R53.1
N$1989: PIXEL_23.3(OUT2) R54.1
N$1990: C22.2 R56.2
N$1991: C23.2 R57.2
N$1992: C24.1 R58.2
N$2342: PIXEL_22.1(OUT0) R35.1
N$2343: PIXEL_22.2(OUT1) R36.1
N$2344: PIXEL_22.3(OUT2) R37.1
N$2345: CB4.2 RB4.2
N$2346: LED22.1(R) R37.2
N$2347: LED22.4(B) R36.2
N$2348: LED22.3(G) R35.2
N$2350: R66.2 S24.1(-R)
N$2351: R67.2 S24.2(-G)
N$2352: R68.2 S24.4(-B)
N$2353: PIXEL_24.1(OUT0) R66.1
N$2354: PIXEL_24.2(OUT1) R67.1
N$2355: PIXEL_24.3(OUT2) R68.1
N$2356: C28.2 R70.2
N$2357: C29.2 R71.2
N$2358: C30.1 R72.2
N$2716: R82.2 S31.1(-R)
N$2717: R84.2 S31.2(-G)
N$2718: R85.2 S31.4(-B)
N$2719: PIXEL_31.1(OUT0) R82.1
N$2720: PIXEL_31.2(OUT1) R84.1
N$2721: PIXEL_31.3(OUT2) R85.1
N$2722: C34.2 R89.2
N$2723: C35.2 R91.2
N$2724: C36.1 R93.2
N$3070: PIXEL_33.1(OUT0) R48.1
N$3071: PIXEL_33.2(OUT1) R49.1
N$3072: PIXEL_33.3(OUT2) R50.1
N$3073: CB6.2 RB6.2
N$3074: LED6.1(R) R50.2
N$3075: LED6.4(B) R49.2
N$3076: LED6.3(G) R48.2
N$3082: R102.2 S34.1(-R)
N$3083: R103.2 S34.2(-G)
N$3084: R104.2 S34.4(-B)
N$3085: PIXEL_34.1(OUT0) R102.1
N$3086: PIXEL_34.2(OUT1) R103.1
N$3087: PIXEL_34.3(OUT2) R104.1
N$3088: C40.2 R106.2
N$3089: C41.2 R107.2
N$3090: C42.1 R108.2
N$3448: R116.2 S35.1(-R)
N$3449: R117.2 S35.2(-G)
N$3450: R118.2 S35.4(-B)
N$3451: PIXEL_35.1(OUT0) R116.1
N$3452: PIXEL_35.2(OUT1) R117.1
N$3453: PIXEL_35.3(OUT2) R118.1
N$3454: C46.2 R120.2
N$3455: C47.2 R121.2
N$3456: C48.1 R122.2
PIXEL42: PIXEL_14.6(SDI) ; also sheet 3
RST: CONN_STH_BRD_2.3 MCP_000.18(!RESET) MCP_001.18(!RESET) ; also sheet 1,3,4,5,6
SPI1_MOSI: CONN_STH_BRD_2.6 ; also sheet 1,3
SPI3_MOSI: CONN_STH_BRD_2.19 ; also sheet 1,4
Unconnected: MCP_001.1(GPB0) PIXEL_11.7(TEST) PIXEL_12.7(TEST) PIXEL_13.7(TEST) PIXEL_14.7(TEST) PIXEL_21.7(TEST) PIXEL_22.7(TEST) PIXEL_23.7(TEST) PIXEL_24.7(TEST) PIXEL_31.5(SDO) PIXEL_31.7(TEST) PIXEL_32.7(TEST) PIXEL_33.7(TEST) PIXEL_34.7(TEST) PIXEL_35.7(TEST)

### Notes on the sheet
- OSCILLATORS
- RGB ENCODER 35
- RGB ENCODER 14 | RGB ENCODER 24 | RGB ENCODER 34
- MCP 11 & 12
- RGB ENCODER 13 | RGB ENCODER 23 | SWITCH RGB 33
- SWITCH RGB 12 | SWITCH RGB 22 | SWITCH RGB 32
- RGB ENCODER 11 | RGB ENCODER 21 | RGB ENCODER 31

## Sheet 3 of 8
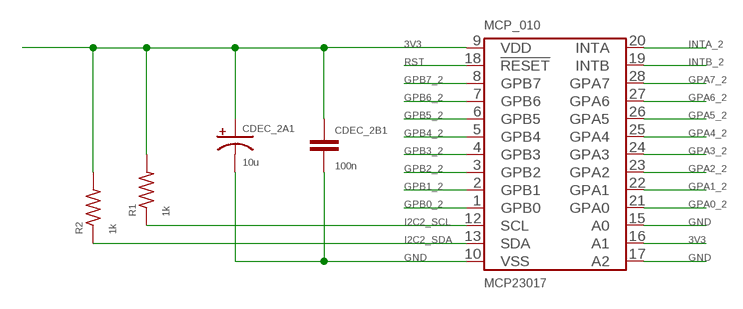
[diagram p6: schematic, sheet 3, part 1 of 2]
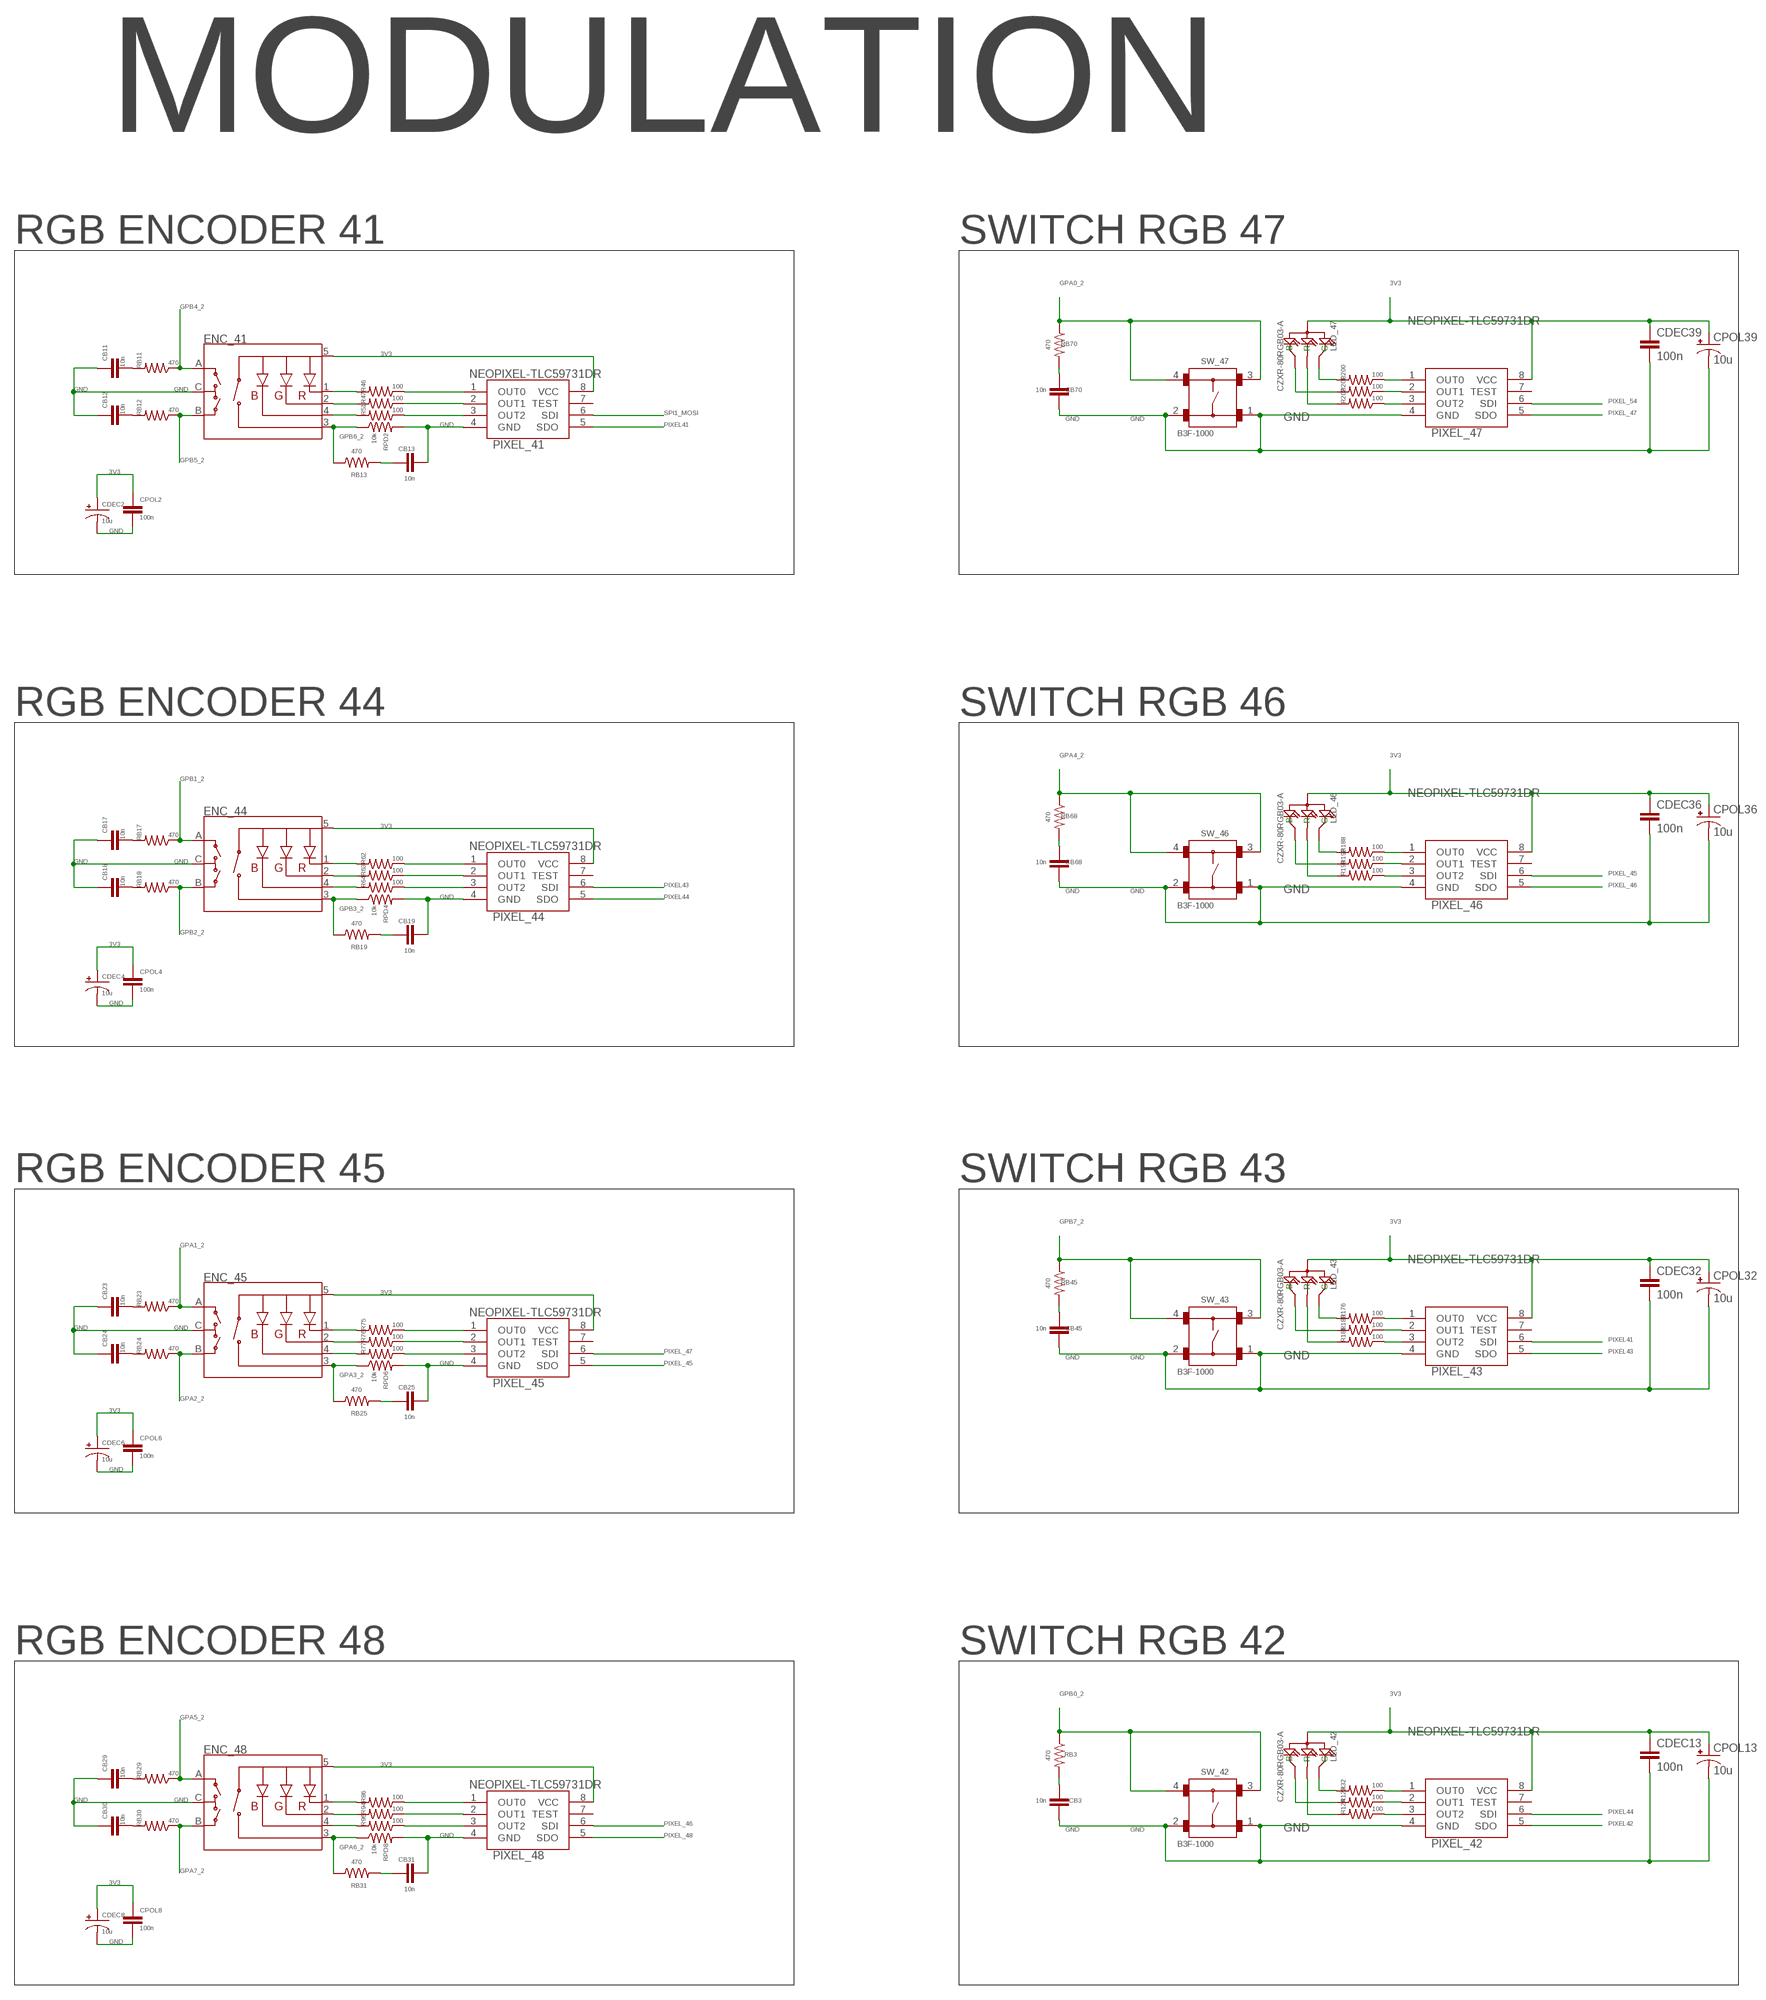
[diagram p7: schematic, sheet 3, part 2 of 2]

### Parts
CB3  10n  PASSIF-CAP-0805  [0805-CAP]
CB11  10n  PASSIF-CAP-0805  [0805-CAP]
CB12  10n  PASSIF-CAP-0805  [0805-CAP]
CB13  10n  PASSIF-CAP-0805  [0805-CAP]
CB17  10n  PASSIF-CAP-0805  [0805-CAP]
CB18  10n  PASSIF-CAP-0805  [0805-CAP]
CB19  10n  PASSIF-CAP-0805  [0805-CAP]
CB23  10n  PASSIF-CAP-0805  [0805-CAP]
CB24  10n  PASSIF-CAP-0805  [0805-CAP]
CB25  10n  PASSIF-CAP-0805  [0805-CAP]
CB29  10n  PASSIF-CAP-0805  [0805-CAP]
CB30  10n  PASSIF-CAP-0805  [0805-CAP]
CB31  10n  PASSIF-CAP-0805  [0805-CAP]
CB45  10n  PASSIF-CAP-0805  [0805-CAP]
CB68  10n  PASSIF-CAP-0805  [0805-CAP]
CB70  10n  PASSIF-CAP-0805  [0805-CAP]
CDEC2  10u  PASSIF-CPOL-US2917  [CPOL2917]
CDEC4  10u  PASSIF-CPOL-US2917  [CPOL2917]
CDEC6  10u  PASSIF-CPOL-US2917  [CPOL2917]
CDEC8  10u  PASSIF-CPOL-US2917  [CPOL2917]
CDEC13  100n  PASSIF-CAP-0805  [0805-CAP]
CDEC32  100n  PASSIF-CAP-0805  [0805-CAP]
CDEC36  100n  PASSIF-CAP-0805  [0805-CAP]
CDEC39  100n  PASSIF-CAP-0805  [0805-CAP]
CDEC_2A1  10u  PASSIF-CPOL-US2917  [CPOL2917]
CDEC_2B1  100n  PASSIF-CAP-0805  [0805-CAP]
CPOL2  100n  PASSIF-CAP-0805  [0805-CAP]
CPOL4  100n  PASSIF-CAP-0805  [0805-CAP]
CPOL6  100n  PASSIF-CAP-0805  [0805-CAP]
CPOL8  100n  PASSIF-CAP-0805  [0805-CAP]
CPOL13  10u  PASSIF-CPOL-US2917  [CPOL2917]
CPOL32  10u  PASSIF-CPOL-US2917  [CPOL2917]
CPOL36  10u  PASSIF-CPOL-US2917  [CPOL2917]
CPOL39  10u  PASSIF-CPOL-US2917  [CPOL2917]
ENC_41  ENCODER-RGB-SWITCH-NO_NUT  [ENCODER_LED_3]
ENC_44  ENCODER-RGB-SWITCH-NO_NUT  [ENCODER_LED_3]
ENC_45  ENCODER-RGB-SWITCH-NO_NUT  [ENCODER_LED_3]
ENC_48  ENCODER-RGB-SWITCH-NO_NUT  [ENCODER_LED_3]
LED_42  CZXR-80RGB03-A  DIP-LED-RGB-COMMON-ANODE(4P-D8MM)  [LED4-2.0-D8.0MM]
LED_43  CZXR-80RGB03-A  DIP-LED-RGB-COMMON-ANODE(4P-D8MM)  [LED4-2.0-D8.0MM]
LED_46  CZXR-80RGB03-A  DIP-LED-RGB-COMMON-ANODE(4P-D8MM)  [LED4-2.0-D8.0MM]
LED_47  CZXR-80RGB03-A  DIP-LED-RGB-COMMON-ANODE(4P-D8MM)  [LED4-2.0-D8.0MM]
MCP_010  MCP23017  [SOIC-28]
PIXEL_41  NEOPIXEL-TLC59731DR  [SOIC127P600X175-8N]
PIXEL_42  NEOPIXEL-TLC59731DR  [SOIC127P600X175-8N]
PIXEL_43  NEOPIXEL-TLC59731DR  [SOIC127P600X175-8N]
PIXEL_44  NEOPIXEL-TLC59731DR  [SOIC127P600X175-8N]
PIXEL_45  NEOPIXEL-TLC59731DR  [SOIC127P600X175-8N]
PIXEL_46  NEOPIXEL-TLC59731DR  [SOIC127P600X175-8N]
PIXEL_47  NEOPIXEL-TLC59731DR  [SOIC127P600X175-8N]
PIXEL_48  NEOPIXEL-TLC59731DR  [SOIC127P600X175-8N]
R1  1k  R-US_R0805  [R0805]
R2  1k  R-US_R0805  [R0805]
R32  100  PASSIF-RESISTOR-1206  [1206]
R46  100  PASSIF-RESISTOR-1206  [1206]
R47  100  PASSIF-RESISTOR-1206  [1206]
R51  100  PASSIF-RESISTOR-1206  [1206]
R62  100  PASSIF-RESISTOR-1206  [1206]
R63  100  PASSIF-RESISTOR-1206  [1206]
R64  100  PASSIF-RESISTOR-1206  [1206]
R75  100  PASSIF-RESISTOR-1206  [1206]
R76  100  PASSIF-RESISTOR-1206  [1206]
R77  100  PASSIF-RESISTOR-1206  [1206]
R86  100  PASSIF-RESISTOR-1206  [1206]
R94  100  PASSIF-RESISTOR-1206  [1206]
R96  100  PASSIF-RESISTOR-1206  [1206]
R123  100  PASSIF-RESISTOR-1206  [1206]
R124  100  PASSIF-RESISTOR-1206  [1206]
R176  100  PASSIF-RESISTOR-1206  [1206]
R180  100  PASSIF-RESISTOR-1206  [1206]
R181  100  PASSIF-RESISTOR-1206  [1206]
R188  100  PASSIF-RESISTOR-1206  [1206]
R192  100  PASSIF-RESISTOR-1206  [1206]
R193  100  PASSIF-RESISTOR-1206  [1206]
R200  100  PASSIF-RESISTOR-1206  [1206]
R201  100  PASSIF-RESISTOR-1206  [1206]
R202  100  PASSIF-RESISTOR-1206  [1206]
RB3  470  PASSIF-RESISTOR-1206  [1206]
RB11  470  PASSIF-RESISTOR-1206  [1206]
RB12  470  PASSIF-RESISTOR-1206  [1206]
RB13  470  PASSIF-RESISTOR-1206  [1206]
RB17  470  PASSIF-RESISTOR-1206  [1206]
RB18  470  PASSIF-RESISTOR-1206  [1206]
RB19  470  PASSIF-RESISTOR-1206  [1206]
RB23  470  PASSIF-RESISTOR-1206  [1206]
RB24  470  PASSIF-RESISTOR-1206  [1206]
RB25  470  PASSIF-RESISTOR-1206  [1206]
RB29  470  PASSIF-RESISTOR-1206  [1206]
RB30  470  PASSIF-RESISTOR-1206  [1206]
RB31  470  PASSIF-RESISTOR-1206  [1206]
RB45  470  PASSIF-RESISTOR-1206  [1206]
RB68  470  PASSIF-RESISTOR-1206  [1206]
RB70  470  PASSIF-RESISTOR-1206  [1206]
RPD2  10k  PASSIF-RESISTOR-1206  [1206]
RPD4  10k  PASSIF-RESISTOR-1206  [1206]
RPD6  10k  PASSIF-RESISTOR-1206  [1206]
RPD8  10k  PASSIF-RESISTOR-1206  [1206]
SW_42  B3F-1000  [B3F-1000]
SW_43  B3F-1000  [B3F-1000]
SW_46  B3F-1000  [B3F-1000]
SW_47  B3F-1000  [B3F-1000]

### Nets
3V3: CDEC2.+ CDEC4.+ CDEC6.+ CDEC8.+ CDEC13.1 CDEC32.1 CDEC36.1 CDEC39.1 CDEC_2A1.+ CDEC_2B1.1 CPOL2.1 CPOL4.1 CPOL6.1 CPOL8.1 CPOL13.+ CPOL32.+ CPOL36.+ CPOL39.+ ENC_41.5(+) ENC_44.5(+) ENC_45.5(+) ENC_48.5(+) LED_42.2(+) LED_43.2(+) LED_46.2(+) LED_47.2(+) MCP_010.9(VDD) MCP_010.16(A1) PIXEL_41.8(VCC) PIXEL_42.8(VCC) PIXEL_43.8(VCC) PIXEL_44.8(VCC) PIXEL_45.8(VCC) PIXEL_46.8(VCC) PIXEL_47.8(VCC) PIXEL_48.8(VCC) R1.2 R2.2 ; also sheet 1,2,4,5,6,7
GND: CB3.1 CB11.1 CB12.1 CB13.2 CB17.1 CB18.1 CB19.2 CB23.1 CB24.1 CB25.2 CB29.1 CB30.1 CB31.2 CB45.1 CB68.1 CB70.1 CDEC2.- CDEC4.- CDEC6.- CDEC8.- CDEC13.2 CDEC32.2 CDEC36.2 CDEC39.2 CDEC_2A1.- CDEC_2B1.2 CPOL2.2 CPOL4.2 CPOL6.2 CPOL8.2 CPOL13.- CPOL32.- CPOL36.- CPOL39.- ENC_41.C ENC_44.C ENC_45.C ENC_48.C MCP_010.10(VSS) MCP_010.15(A0) MCP_010.17(A2) PIXEL_41.4(GND) PIXEL_42.4(GND) PIXEL_43.4(GND) PIXEL_44.4(GND) PIXEL_45.4(GND) PIXEL_46.4(GND) PIXEL_47.4(GND) PIXEL_48.4(GND) RPD2.2 RPD4.2 RPD6.2 RPD8.2 SW_42.1 SW_42.2 SW_43.1 SW_43.2 SW_46.1 SW_46.2 SW_47.1 SW_47.2 ; also sheet 1,2,4,5,6,7
GPA0_2: MCP_010.21(GPA0) RB70.1 SW_47.3 SW_47.4
GPA1_2: ENC_45.A MCP_010.22(GPA1) RB23.1
GPA2_2: ENC_45.B MCP_010.23(GPA2) RB24.1
GPA3_2: ENC_45.3(SW) MCP_010.24(GPA3) RB25.1 RPD6.1
GPA4_2: MCP_010.25(GPA4) RB68.1 SW_46.3 SW_46.4
GPA5_2: ENC_48.A MCP_010.26(GPA5) RB29.1
GPA6_2: ENC_48.3(SW) MCP_010.27(GPA6) RB31.1 RPD8.1
GPA7_2: ENC_48.B MCP_010.28(GPA7) RB30.1
GPB0_2: MCP_010.1(GPB0) RB3.1 SW_42.3 SW_42.4
GPB1_2: ENC_44.A MCP_010.2(GPB1) RB17.1
GPB2_2: ENC_44.B MCP_010.3(GPB2) RB18.1
GPB3_2: ENC_44.3(SW) MCP_010.4(GPB3) RB19.1 RPD4.1
GPB4_2: ENC_41.A MCP_010.5(GPB4) RB11.1
GPB5_2: ENC_41.B MCP_010.6(GPB5) RB12.1
GPB6_2: ENC_41.3(SW) MCP_010.7(GPB6) RB13.1 RPD2.1
GPB7_2: MCP_010.8(GPB7) RB45.1 SW_43.3 SW_43.4
I2C2_SCL: MCP_010.12(SCL) R1.1 ; also sheet 1,2,4
I2C2_SDA: MCP_010.13(SDA) R2.1 ; also sheet 1,2,4
INTA_2: MCP_010.20(INTA) ; also sheet 2
INTB_2: MCP_010.19(INTB) ; also sheet 2
N$709: PIXEL_42.1(OUT0) R32.1
N$1978: PIXEL_42.2(OUT1) R123.1
N$2709: ENC_41.1(-R) R46.2
N$2710: ENC_41.2(-G) R47.2
N$2711: ENC_41.4(-B) R51.2
N$2712: PIXEL_41.1(OUT0) R46.1
N$2713: PIXEL_41.2(OUT1) R47.1
N$2714: PIXEL_41.3(OUT2) R51.1
N$2715: CB11.2 RB11.2
N$2899: CB12.2 RB12.2
N$2900: CB13.1 RB13.2
N$3814: ENC_44.1(-R) R62.2
N$3815: ENC_44.2(-G) R63.2
N$3816: ENC_44.4(-B) R64.2
N$3817: PIXEL_44.1(OUT0) R62.1
N$3818: PIXEL_44.2(OUT1) R63.1
N$3819: PIXEL_44.3(OUT2) R64.1
N$3820: CB17.2 RB17.2
N$3821: CB18.2 RB18.2
N$3822: CB19.1 RB19.2
N$4867: ENC_45.1(-R) R75.2
N$4868: ENC_45.2(-G) R76.2
N$4869: ENC_45.4(-B) R77.2
N$4870: PIXEL_45.1(OUT0) R75.1
N$4871: PIXEL_45.2(OUT1) R76.1
N$4872: PIXEL_45.3(OUT2) R77.1
N$4873: CB23.2 RB23.2
N$4874: CB24.2 RB24.2
N$4875: CB25.1 RB25.2
N$5233: ENC_48.1(-R) R86.2
N$5234: ENC_48.2(-G) R94.2
N$5235: ENC_48.4(-B) R96.2
N$5236: PIXEL_48.1(OUT0) R86.1
N$5237: PIXEL_48.2(OUT1) R94.1
N$5238: PIXEL_48.3(OUT2) R96.1
N$5239: CB29.2 RB29.2
N$5240: CB30.2 RB30.2
N$5241: CB31.1 RB31.2
N$6148: PIXEL_42.3(OUT2) R124.1
N$6149: CB3.2 RB3.2
N$6150: LED_42.1(R) R124.2
N$6151: LED_42.4(B) R123.2
N$6152: LED_42.3(G) R32.2
N$9432: PIXEL_43.1(OUT0) R176.1
N$9433: PIXEL_43.2(OUT1) R180.1
N$9434: PIXEL_43.3(OUT2) R181.1
N$9435: CB45.2 RB45.2
N$9436: LED_43.1(R) R181.2
N$9437: LED_43.4(B) R180.2
N$9438: LED_43.3(G) R176.2
N$10160: PIXEL_46.1(OUT0) R188.1
N$10161: PIXEL_46.2(OUT1) R192.1
N$10162: PIXEL_46.3(OUT2) R193.1
N$10163: CB68.2 RB68.2
N$10164: LED_46.1(R) R193.2
N$10165: LED_46.4(B) R192.2
N$10166: LED_46.3(G) R188.2
N$10888: PIXEL_47.1(OUT0) R200.1
N$10889: PIXEL_47.2(OUT1) R201.1
N$10890: PIXEL_47.3(OUT2) R202.1
N$10891: CB70.2 RB70.2
N$10892: LED_47.1(R) R202.2
N$10893: LED_47.4(B) R201.2
N$10894: LED_47.3(G) R200.2
PIXEL41: PIXEL_41.5(SDO) PIXEL_43.6(SDI)
PIXEL42: PIXEL_42.5(SDO) ; also sheet 2
PIXEL43: PIXEL_43.5(SDO) PIXEL_44.6(SDI)
PIXEL44: PIXEL_42.6(SDI) PIXEL_44.5(SDO)
PIXEL_45: PIXEL_45.5(SDO) PIXEL_46.6(SDI)
PIXEL_46: PIXEL_46.5(SDO) PIXEL_48.6(SDI)
PIXEL_47: PIXEL_45.6(SDI) PIXEL_47.5(SDO)
PIXEL_48: PIXEL_48.5(SDO) ; also sheet 4
PIXEL_54: PIXEL_47.6(SDI) ; also sheet 4
RST: MCP_010.18(!RESET) ; also sheet 1,2,4,5,6
SPI1_MOSI: PIXEL_41.6(SDI) ; also sheet 1,2
Unconnected: PIXEL_41.7(TEST) PIXEL_42.7(TEST) PIXEL_43.7(TEST) PIXEL_44.7(TEST) PIXEL_45.7(TEST) PIXEL_46.7(TEST) PIXEL_47.7(TEST) PIXEL_48.7(TEST)

### Notes on the sheet
- MODULATION
- RGB ENCODER 41 | SWITCH RGB 47
- RGB ENCODER 44 | SWITCH RGB 46
- RGB ENCODER 45 | SWITCH RGB 43
- RGB ENCODER 48 | SWITCH RGB 42

## Sheet 4 of 8
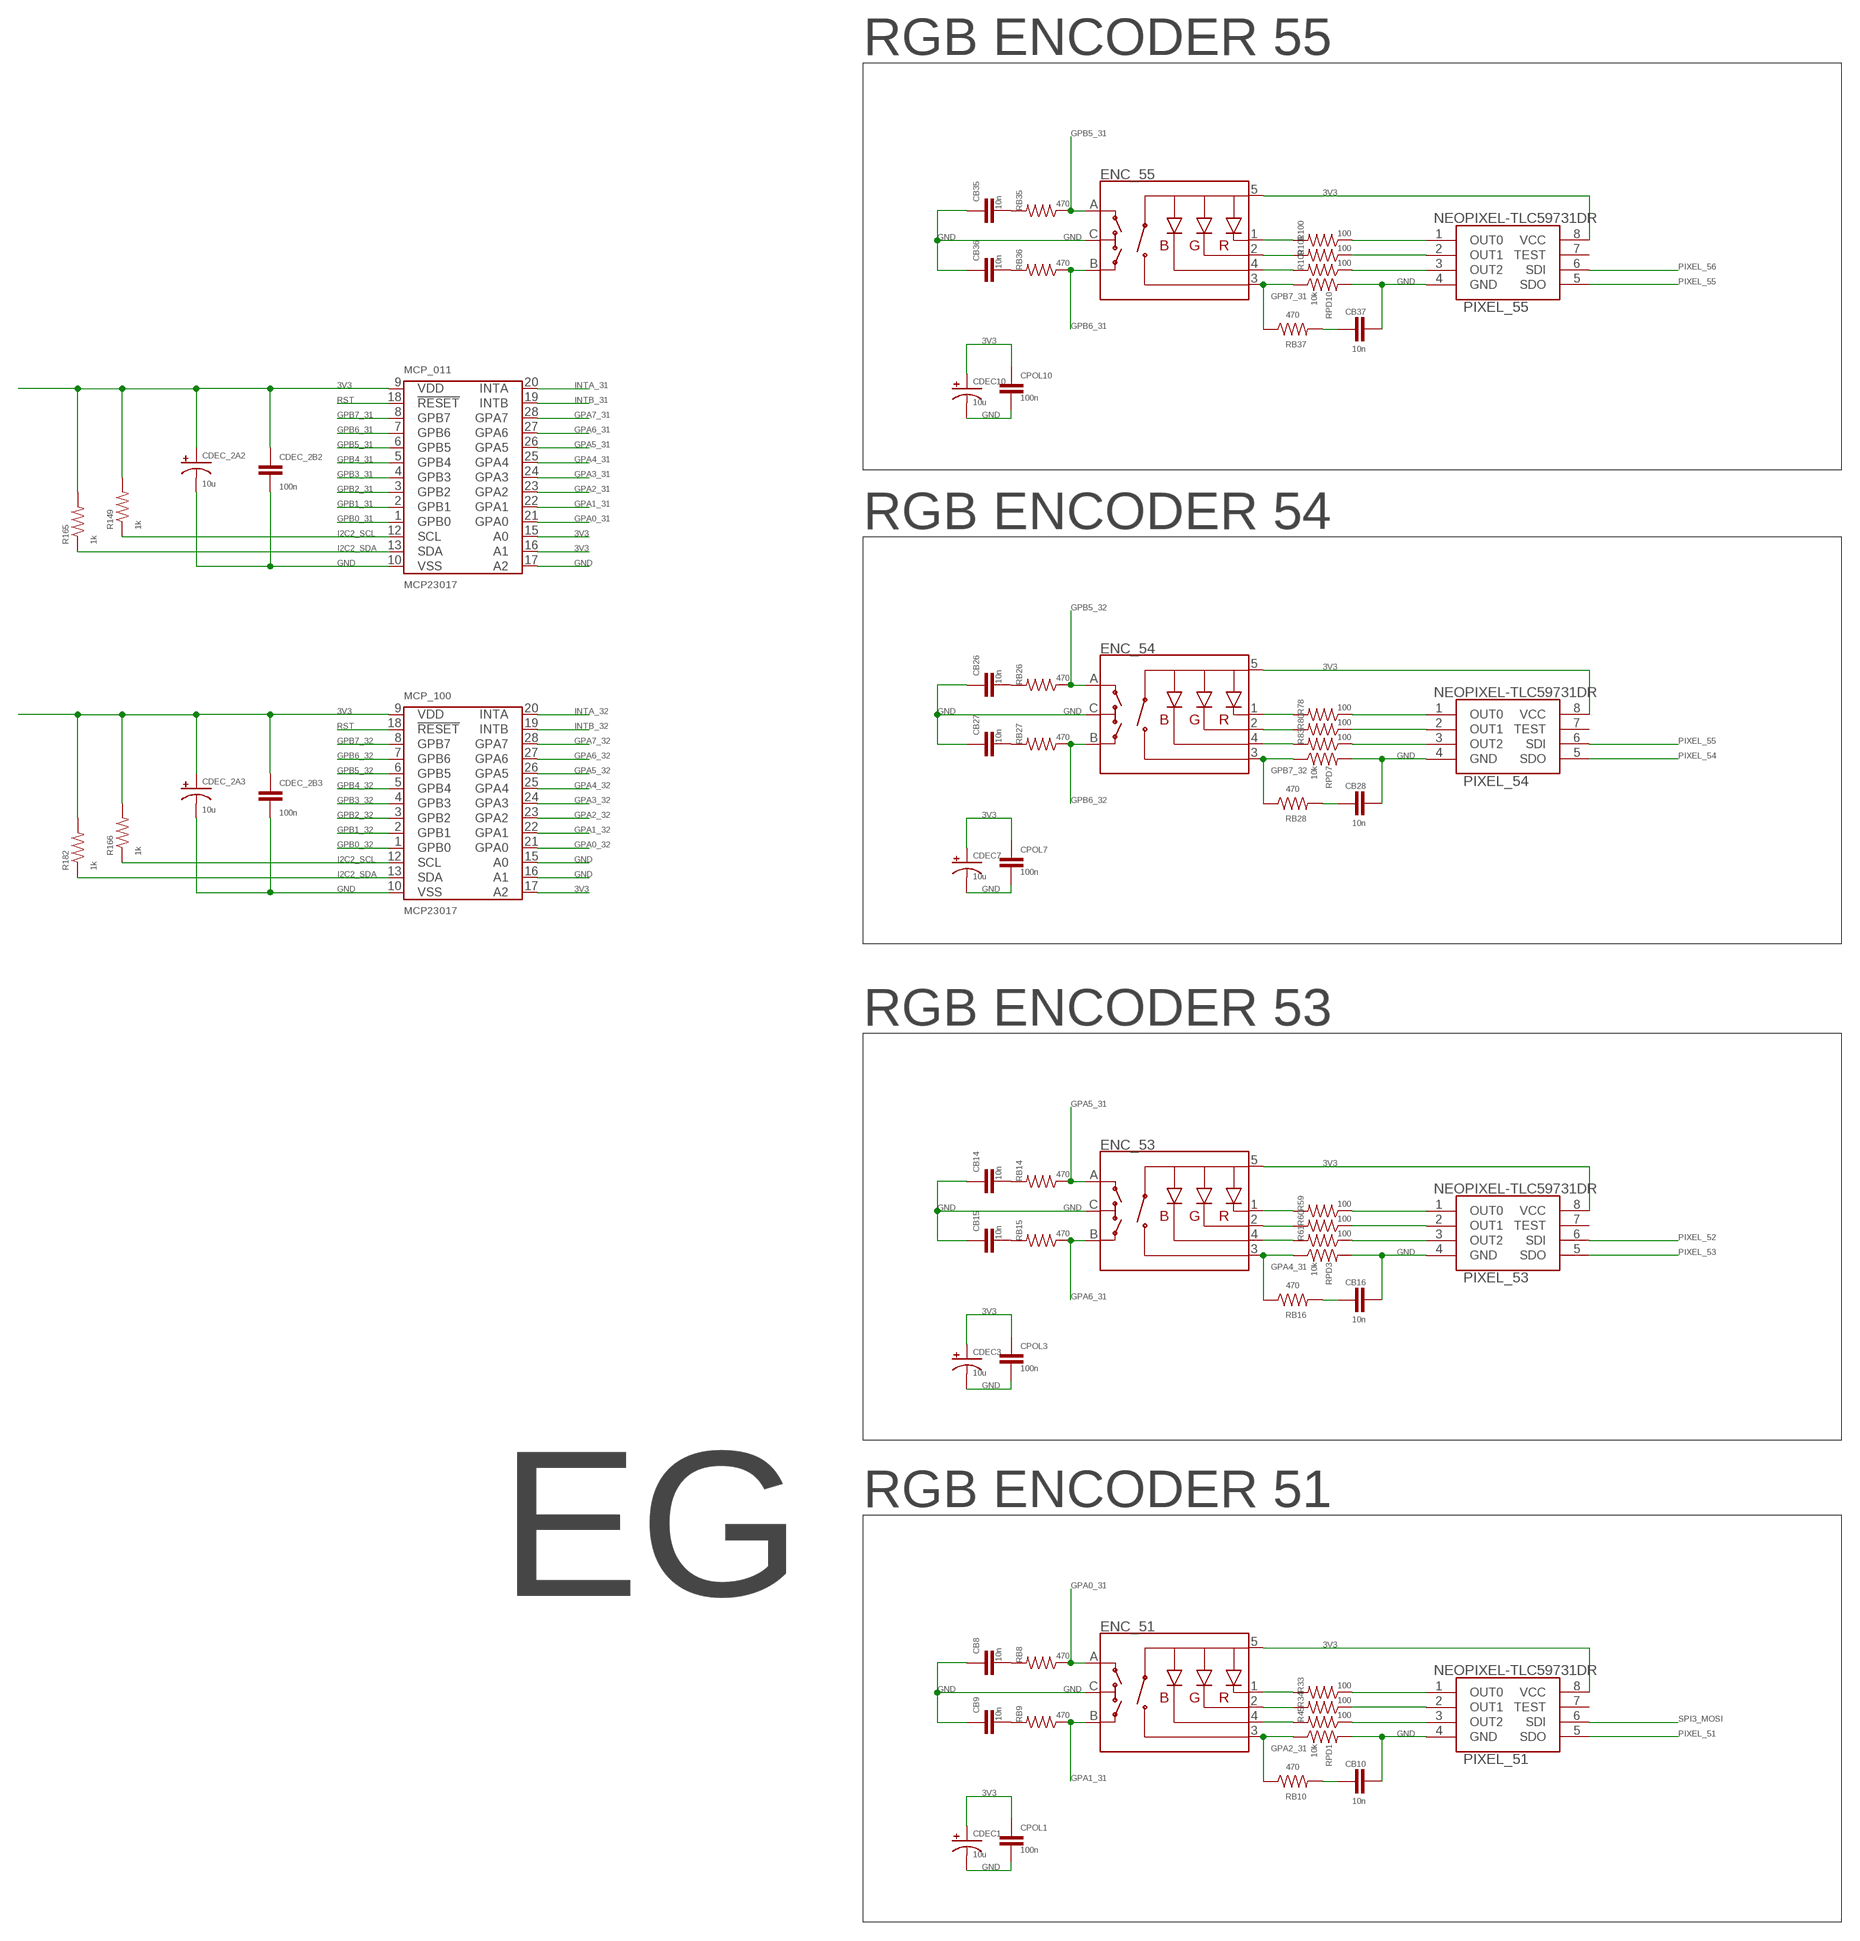
[diagram p8: schematic, sheet 4, part 1 of 2]
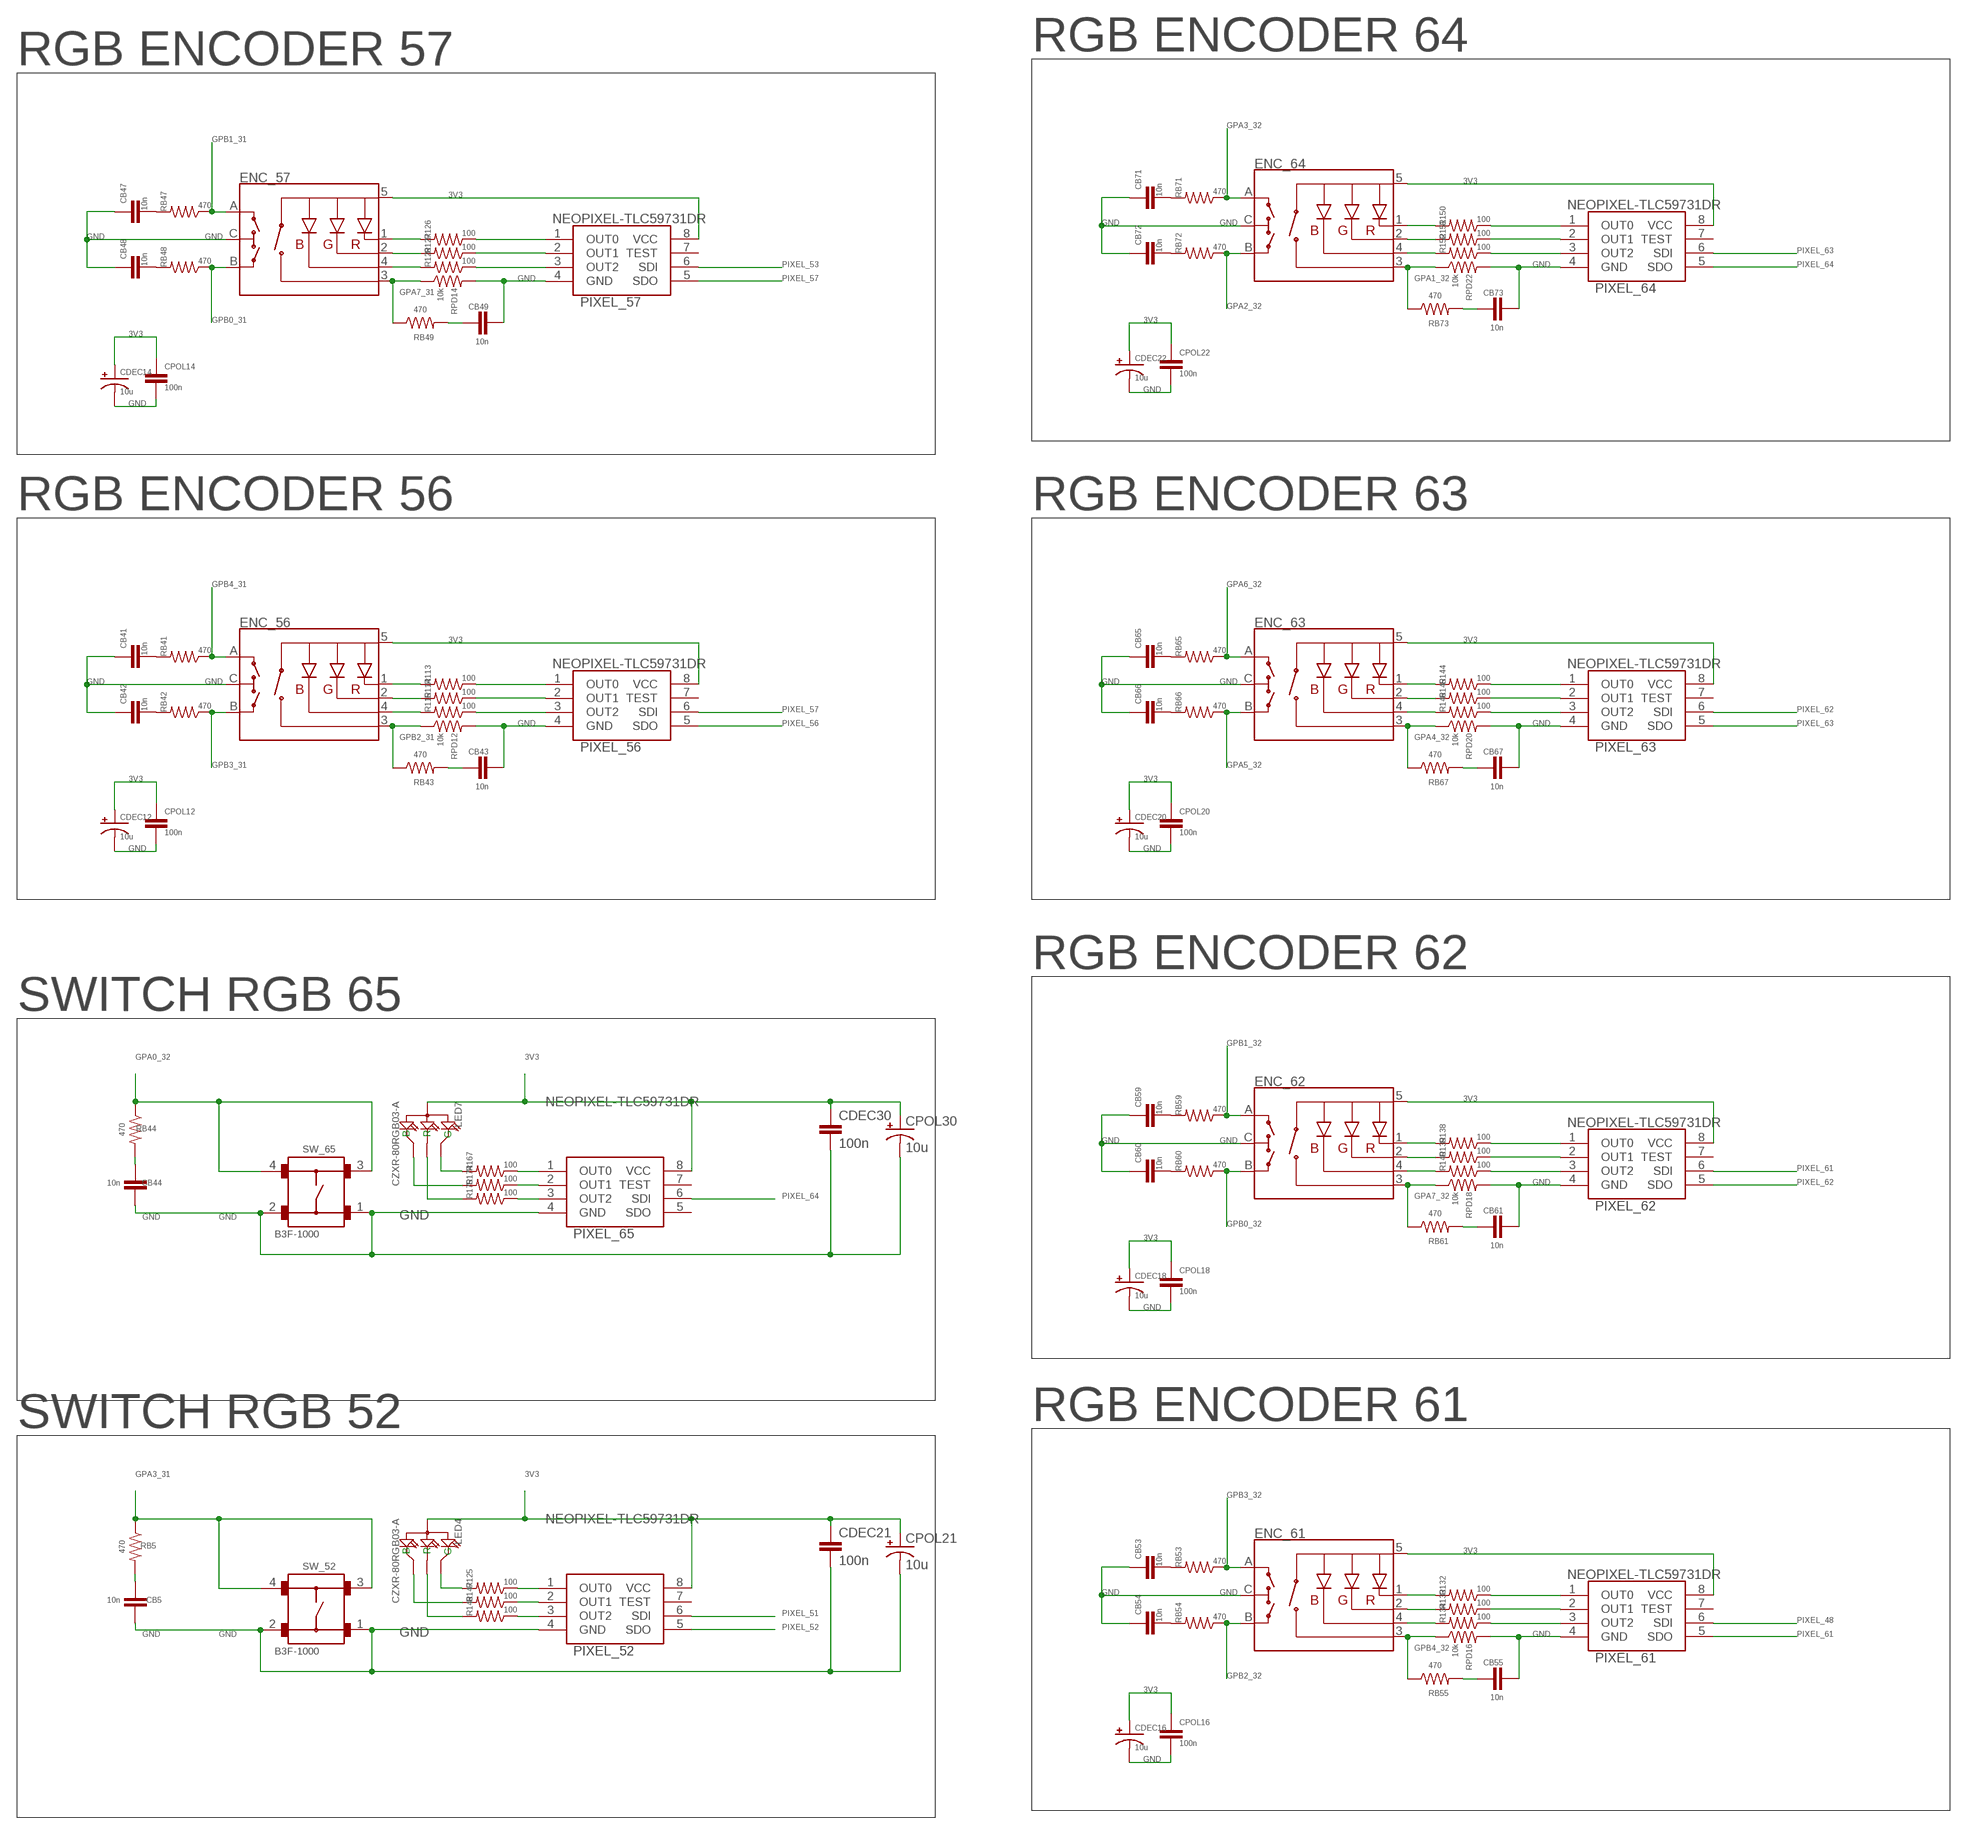
[diagram p9: schematic, sheet 4, part 2 of 2]

### Parts
CB5  10n  PASSIF-CAP-0805  [0805-CAP]
CB8  10n  PASSIF-CAP-0805  [0805-CAP]
CB9  10n  PASSIF-CAP-0805  [0805-CAP]
CB10  10n  PASSIF-CAP-0805  [0805-CAP]
CB14  10n  PASSIF-CAP-0805  [0805-CAP]
CB15  10n  PASSIF-CAP-0805  [0805-CAP]
CB16  10n  PASSIF-CAP-0805  [0805-CAP]
CB26  10n  PASSIF-CAP-0805  [0805-CAP]
CB27  10n  PASSIF-CAP-0805  [0805-CAP]
CB28  10n  PASSIF-CAP-0805  [0805-CAP]
CB35  10n  PASSIF-CAP-0805  [0805-CAP]
CB36  10n  PASSIF-CAP-0805  [0805-CAP]
CB37  10n  PASSIF-CAP-0805  [0805-CAP]
CB41  10n  PASSIF-CAP-0805  [0805-CAP]
CB42  10n  PASSIF-CAP-0805  [0805-CAP]
CB43  10n  PASSIF-CAP-0805  [0805-CAP]
CB44  10n  PASSIF-CAP-0805  [0805-CAP]
CB47  10n  PASSIF-CAP-0805  [0805-CAP]
CB48  10n  PASSIF-CAP-0805  [0805-CAP]
CB49  10n  PASSIF-CAP-0805  [0805-CAP]
CB53  10n  PASSIF-CAP-0805  [0805-CAP]
CB54  10n  PASSIF-CAP-0805  [0805-CAP]
CB55  10n  PASSIF-CAP-0805  [0805-CAP]
CB59  10n  PASSIF-CAP-0805  [0805-CAP]
CB60  10n  PASSIF-CAP-0805  [0805-CAP]
CB61  10n  PASSIF-CAP-0805  [0805-CAP]
CB65  10n  PASSIF-CAP-0805  [0805-CAP]
CB66  10n  PASSIF-CAP-0805  [0805-CAP]
CB67  10n  PASSIF-CAP-0805  [0805-CAP]
CB71  10n  PASSIF-CAP-0805  [0805-CAP]
CB72  10n  PASSIF-CAP-0805  [0805-CAP]
CB73  10n  PASSIF-CAP-0805  [0805-CAP]
CDEC1  10u  PASSIF-CPOL-US2917  [CPOL2917]
CDEC3  10u  PASSIF-CPOL-US2917  [CPOL2917]
CDEC7  10u  PASSIF-CPOL-US2917  [CPOL2917]
CDEC10  10u  PASSIF-CPOL-US2917  [CPOL2917]
CDEC12  10u  PASSIF-CPOL-US2917  [CPOL2917]
CDEC14  10u  PASSIF-CPOL-US2917  [CPOL2917]
CDEC16  10u  PASSIF-CPOL-US2917  [CPOL2917]
CDEC18  10u  PASSIF-CPOL-US2917  [CPOL2917]
CDEC20  10u  PASSIF-CPOL-US2917  [CPOL2917]
CDEC21  100n  PASSIF-CAP-0805  [0805-CAP]
CDEC22  10u  PASSIF-CPOL-US2917  [CPOL2917]
CDEC30  100n  PASSIF-CAP-0805  [0805-CAP]
CDEC_2A2  10u  PASSIF-CPOL-US2917  [CPOL2917]
CDEC_2A3  10u  PASSIF-CPOL-US2917  [CPOL2917]
CDEC_2B2  100n  PASSIF-CAP-0805  [0805-CAP]
CDEC_2B3  100n  PASSIF-CAP-0805  [0805-CAP]
CPOL1  100n  PASSIF-CAP-0805  [0805-CAP]
CPOL3  100n  PASSIF-CAP-0805  [0805-CAP]
CPOL7  100n  PASSIF-CAP-0805  [0805-CAP]
CPOL10  100n  PASSIF-CAP-0805  [0805-CAP]
CPOL12  100n  PASSIF-CAP-0805  [0805-CAP]
CPOL14  100n  PASSIF-CAP-0805  [0805-CAP]
CPOL16  100n  PASSIF-CAP-0805  [0805-CAP]
CPOL18  100n  PASSIF-CAP-0805  [0805-CAP]
CPOL20  100n  PASSIF-CAP-0805  [0805-CAP]
CPOL21  10u  PASSIF-CPOL-US2917  [CPOL2917]
CPOL22  100n  PASSIF-CAP-0805  [0805-CAP]
CPOL30  10u  PASSIF-CPOL-US2917  [CPOL2917]
ENC_51  ENCODER-RGB-SWITCH-NO_NUT  [ENCODER_LED_3]
ENC_53  ENCODER-RGB-SWITCH-NO_NUT  [ENCODER_LED_3]
ENC_54  ENCODER-RGB-SWITCH-NO_NUT  [ENCODER_LED_3]
ENC_55  ENCODER-RGB-SWITCH-NO_NUT  [ENCODER_LED_3]
ENC_56  ENCODER-RGB-SWITCH-NO_NUT  [ENCODER_LED_3]
ENC_57  ENCODER-RGB-SWITCH-NO_NUT  [ENCODER_LED_3]
ENC_61  ENCODER-RGB-SWITCH-NO_NUT  [ENCODER_LED_3]
ENC_62  ENCODER-RGB-SWITCH-NO_NUT  [ENCODER_LED_3]
ENC_63  ENCODER-RGB-SWITCH-NO_NUT  [ENCODER_LED_3]
ENC_64  ENCODER-RGB-SWITCH-NO_NUT  [ENCODER_LED_3]
LED4  CZXR-80RGB03-A  DIP-LED-RGB-COMMON-ANODE(4P-D8MM)  [LED4-2.0-D8.0MM]
LED7  CZXR-80RGB03-A  DIP-LED-RGB-COMMON-ANODE(4P-D8MM)  [LED4-2.0-D8.0MM]
MCP_011  MCP23017  [SOIC-28]
MCP_100  MCP23017  [SOIC-28]
PIXEL_51  NEOPIXEL-TLC59731DR  [SOIC127P600X175-8N]
PIXEL_52  NEOPIXEL-TLC59731DR  [SOIC127P600X175-8N]
PIXEL_53  NEOPIXEL-TLC59731DR  [SOIC127P600X175-8N]
PIXEL_54  NEOPIXEL-TLC59731DR  [SOIC127P600X175-8N]
PIXEL_55  NEOPIXEL-TLC59731DR  [SOIC127P600X175-8N]
PIXEL_56  NEOPIXEL-TLC59731DR  [SOIC127P600X175-8N]
PIXEL_57  NEOPIXEL-TLC59731DR  [SOIC127P600X175-8N]
PIXEL_61  NEOPIXEL-TLC59731DR  [SOIC127P600X175-8N]
PIXEL_62  NEOPIXEL-TLC59731DR  [SOIC127P600X175-8N]
PIXEL_63  NEOPIXEL-TLC59731DR  [SOIC127P600X175-8N]
PIXEL_64  NEOPIXEL-TLC59731DR  [SOIC127P600X175-8N]
PIXEL_65  NEOPIXEL-TLC59731DR  [SOIC127P600X175-8N]
R33  100  PASSIF-RESISTOR-1206  [1206]
R34  100  PASSIF-RESISTOR-1206  [1206]
R45  100  PASSIF-RESISTOR-1206  [1206]
R59  100  PASSIF-RESISTOR-1206  [1206]
R60  100  PASSIF-RESISTOR-1206  [1206]
R61  100  PASSIF-RESISTOR-1206  [1206]
R78  100  PASSIF-RESISTOR-1206  [1206]
R80  100  PASSIF-RESISTOR-1206  [1206]
R83  100  PASSIF-RESISTOR-1206  [1206]
R100  100  PASSIF-RESISTOR-1206  [1206]
R101  100  PASSIF-RESISTOR-1206  [1206]
R109  100  PASSIF-RESISTOR-1206  [1206]
R113  100  PASSIF-RESISTOR-1206  [1206]
R114  100  PASSIF-RESISTOR-1206  [1206]
R115  100  PASSIF-RESISTOR-1206  [1206]
R125  100  PASSIF-RESISTOR-1206  [1206]
R126  100  PASSIF-RESISTOR-1206  [1206]
R127  100  PASSIF-RESISTOR-1206  [1206]
R128  100  PASSIF-RESISTOR-1206  [1206]
R132  100  PASSIF-RESISTOR-1206  [1206]
R133  100  PASSIF-RESISTOR-1206  [1206]
R134  100  PASSIF-RESISTOR-1206  [1206]
R138  100  PASSIF-RESISTOR-1206  [1206]
R139  100  PASSIF-RESISTOR-1206  [1206]
R140  100  PASSIF-RESISTOR-1206  [1206]
R144  100  PASSIF-RESISTOR-1206  [1206]
R145  100  PASSIF-RESISTOR-1206  [1206]
R146  100  PASSIF-RESISTOR-1206  [1206]
R147  100  PASSIF-RESISTOR-1206  [1206]
R148  100  PASSIF-RESISTOR-1206  [1206]
R149  1k  R-US_R0805  [R0805]
R150  100  PASSIF-RESISTOR-1206  [1206]
R151  100  PASSIF-RESISTOR-1206  [1206]
R152  100  PASSIF-RESISTOR-1206  [1206]
R165  1k  R-US_R0805  [R0805]
R166  1k  R-US_R0805  [R0805]
R167  100  PASSIF-RESISTOR-1206  [1206]
R174  100  PASSIF-RESISTOR-1206  [1206]
R175  100  PASSIF-RESISTOR-1206  [1206]
R182  1k  R-US_R0805  [R0805]
RB5  470  PASSIF-RESISTOR-1206  [1206]
RB8  470  PASSIF-RESISTOR-1206  [1206]
RB9  470  PASSIF-RESISTOR-1206  [1206]
RB10  470  PASSIF-RESISTOR-1206  [1206]
RB14  470  PASSIF-RESISTOR-1206  [1206]
RB15  470  PASSIF-RESISTOR-1206  [1206]
RB16  470  PASSIF-RESISTOR-1206  [1206]
RB26  470  PASSIF-RESISTOR-1206  [1206]
RB27  470  PASSIF-RESISTOR-1206  [1206]
RB28  470  PASSIF-RESISTOR-1206  [1206]
RB35  470  PASSIF-RESISTOR-1206  [1206]
RB36  470  PASSIF-RESISTOR-1206  [1206]
RB37  470  PASSIF-RESISTOR-1206  [1206]
RB41  470  PASSIF-RESISTOR-1206  [1206]
RB42  470  PASSIF-RESISTOR-1206  [1206]
RB43  470  PASSIF-RESISTOR-1206  [1206]
RB44  470  PASSIF-RESISTOR-1206  [1206]
RB47  470  PASSIF-RESISTOR-1206  [1206]
RB48  470  PASSIF-RESISTOR-1206  [1206]
RB49  470  PASSIF-RESISTOR-1206  [1206]
RB53  470  PASSIF-RESISTOR-1206  [1206]
RB54  470  PASSIF-RESISTOR-1206  [1206]
RB55  470  PASSIF-RESISTOR-1206  [1206]
RB59  470  PASSIF-RESISTOR-1206  [1206]
RB60  470  PASSIF-RESISTOR-1206  [1206]
RB61  470  PASSIF-RESISTOR-1206  [1206]
RB65  470  PASSIF-RESISTOR-1206  [1206]
RB66  470  PASSIF-RESISTOR-1206  [1206]
RB67  470  PASSIF-RESISTOR-1206  [1206]
RB71  470  PASSIF-RESISTOR-1206  [1206]
RB72  470  PASSIF-RESISTOR-1206  [1206]
RB73  470  PASSIF-RESISTOR-1206  [1206]
RPD1  10k  PASSIF-RESISTOR-1206  [1206]
RPD3  10k  PASSIF-RESISTOR-1206  [1206]
RPD7  10k  PASSIF-RESISTOR-1206  [1206]
RPD10  10k  PASSIF-RESISTOR-1206  [1206]
RPD12  10k  PASSIF-RESISTOR-1206  [1206]
RPD14  10k  PASSIF-RESISTOR-1206  [1206]
RPD16  10k  PASSIF-RESISTOR-1206  [1206]
RPD18  10k  PASSIF-RESISTOR-1206  [1206]
RPD20  10k  PASSIF-RESISTOR-1206  [1206]
RPD22  10k  PASSIF-RESISTOR-1206  [1206]
SW_52  B3F-1000  [B3F-1000]
SW_65  B3F-1000  [B3F-1000]

### Nets
3V3: CDEC1.+ CDEC3.+ CDEC7.+ CDEC10.+ CDEC12.+ CDEC14.+ CDEC16.+ CDEC18.+ CDEC20.+ CDEC21.1 CDEC22.+ CDEC30.1 CDEC_2A2.+ CDEC_2A3.+ CDEC_2B2.1 CDEC_2B3.1 CPOL1.1 CPOL3.1 CPOL7.1 CPOL10.1 CPOL12.1 CPOL14.1 CPOL16.1 CPOL18.1 CPOL20.1 CPOL21.+ CPOL22.1 CPOL30.+ ENC_51.5(+) ENC_53.5(+) ENC_54.5(+) ENC_55.5(+) ENC_56.5(+) ENC_57.5(+) ENC_61.5(+) ENC_62.5(+) ENC_63.5(+) ENC_64.5(+) LED4.2(+) LED7.2(+) MCP_011.9(VDD) MCP_011.15(A0) MCP_011.16(A1) MCP_100.9(VDD) MCP_100.17(A2) PIXEL_51.8(VCC) PIXEL_52.8(VCC) PIXEL_53.8(VCC) PIXEL_54.8(VCC) PIXEL_55.8(VCC) PIXEL_56.8(VCC) PIXEL_57.8(VCC) PIXEL_61.8(VCC) PIXEL_62.8(VCC) PIXEL_63.8(VCC) PIXEL_64.8(VCC) PIXEL_65.8(VCC) R149.2 R165.2 R166.2 R182.2 ; also sheet 1,2,3,5,6,7
GND: CB5.1 CB8.1 CB9.1 CB10.2 CB14.1 CB15.1 CB16.2 CB26.1 CB27.1 CB28.2 CB35.1 CB36.1 CB37.2 CB41.1 CB42.1 CB43.2 CB44.1 CB47.1 CB48.1 CB49.2 CB53.1 CB54.1 CB55.2 CB59.1 CB60.1 CB61.2 CB65.1 CB66.1 CB67.2 CB71.1 CB72.1 CB73.2 CDEC1.- CDEC3.- CDEC7.- CDEC10.- CDEC12.- CDEC14.- CDEC16.- CDEC18.- CDEC20.- CDEC21.2 CDEC22.- CDEC30.2 CDEC_2A2.- CDEC_2A3.- CDEC_2B2.2 CDEC_2B3.2 CPOL1.2 CPOL3.2 CPOL7.2 CPOL10.2 CPOL12.2 CPOL14.2 CPOL16.2 CPOL18.2 CPOL20.2 CPOL21.- CPOL22.2 CPOL30.- ENC_51.C ENC_53.C ENC_54.C ENC_55.C ENC_56.C ENC_57.C ENC_61.C ENC_62.C ENC_63.C ENC_64.C MCP_011.10(VSS) MCP_011.17(A2) MCP_100.10(VSS) MCP_100.15(A0) MCP_100.16(A1) PIXEL_51.4(GND) PIXEL_52.4(GND) PIXEL_53.4(GND) PIXEL_54.4(GND) PIXEL_55.4(GND) PIXEL_56.4(GND) PIXEL_57.4(GND) PIXEL_61.4(GND) PIXEL_62.4(GND) PIXEL_63.4(GND) PIXEL_64.4(GND) PIXEL_65.4(GND) RPD1.2 RPD3.2 RPD7.2 RPD10.2 RPD12.2 RPD14.2 RPD16.2 RPD18.2 RPD20.2 RPD22.2 SW_52.1 SW_52.2 SW_65.1 SW_65.2 ; also sheet 1,2,3,5,6,7
GPA0_31: ENC_51.A MCP_011.21(GPA0) RB8.1
GPA0_32: MCP_100.21(GPA0) RB44.1 SW_65.3 SW_65.4
GPA1_31: ENC_51.B MCP_011.22(GPA1) RB9.1
GPA1_32: ENC_64.3(SW) MCP_100.22(GPA1) RB73.1 RPD22.1
GPA2_31: ENC_51.3(SW) MCP_011.23(GPA2) RB10.1 RPD1.1
GPA2_32: ENC_64.B MCP_100.23(GPA2) RB72.1
GPA3_31: MCP_011.24(GPA3) RB5.1 SW_52.3 SW_52.4
GPA3_32: ENC_64.A MCP_100.24(GPA3) RB71.1
GPA4_31: ENC_53.3(SW) MCP_011.25(GPA4) RB16.1 RPD3.1
GPA4_32: ENC_63.3(SW) MCP_100.25(GPA4) RB67.1 RPD20.1
GPA5_31: ENC_53.A MCP_011.26(GPA5) RB14.1
GPA5_32: ENC_63.B MCP_100.26(GPA5) RB66.1
GPA6_31: ENC_53.B MCP_011.27(GPA6) RB15.1
GPA6_32: ENC_63.A MCP_100.27(GPA6) RB65.1
GPA7_31: ENC_57.3(SW) MCP_011.28(GPA7) RB49.1 RPD14.1
GPA7_32: ENC_62.3(SW) MCP_100.28(GPA7) RB61.1 RPD18.1
GPB0_31: ENC_57.B MCP_011.1(GPB0) RB48.1
GPB0_32: ENC_62.B MCP_100.1(GPB0) RB60.1
GPB1_31: ENC_57.A MCP_011.2(GPB1) RB47.1
GPB1_32: ENC_62.A MCP_100.2(GPB1) RB59.1
GPB2_31: ENC_56.3(SW) MCP_011.3(GPB2) RB43.1 RPD12.1
GPB2_32: ENC_61.B MCP_100.3(GPB2) RB54.1
GPB3_31: ENC_56.B MCP_011.4(GPB3) RB42.1
GPB3_32: ENC_61.A MCP_100.4(GPB3) RB53.1
GPB4_31: ENC_56.A MCP_011.5(GPB4) RB41.1
GPB4_32: ENC_61.3(SW) MCP_100.5(GPB4) RB55.1 RPD16.1
GPB5_31: ENC_55.A MCP_011.6(GPB5) RB35.1
GPB5_32: ENC_54.A MCP_100.6(GPB5) RB26.1
GPB6_31: ENC_55.B MCP_011.7(GPB6) RB36.1
GPB6_32: ENC_54.B MCP_100.7(GPB6) RB27.1
GPB7_31: ENC_55.3(SW) MCP_011.8(GPB7) RB37.1 RPD10.1
GPB7_32: ENC_54.3(SW) MCP_100.8(GPB7) RB28.1 RPD7.1
I2C2_SCL: MCP_011.12(SCL) MCP_100.12(SCL) R149.1 R166.1 ; also sheet 1,2,3
I2C2_SDA: MCP_011.13(SDA) MCP_100.13(SDA) R165.1 R182.1 ; also sheet 1,2,3
INTA_31: MCP_011.20(INTA) ; also sheet 2
INTA_32: MCP_100.20(INTA) ; also sheet 2
INTB_31: MCP_011.19(INTB) ; also sheet 2
INTB_32: MCP_100.19(INTB) ; also sheet 2
N$1979: ENC_51.1(-R) R33.2
N$1980: ENC_51.2(-G) R34.2
N$1981: ENC_51.4(-B) R45.2
N$1982: PIXEL_51.1(OUT0) R33.1
N$1983: PIXEL_51.2(OUT1) R34.1
N$2167: PIXEL_51.3(OUT2) R45.1
N$2168: CB8.2 RB8.2
N$2169: CB9.2 RB9.2
N$2170: CB10.1 RB10.2
N$3439: ENC_53.1(-R) R59.2
N$3440: ENC_53.2(-G) R60.2
N$3441: ENC_53.4(-B) R61.2
N$3442: PIXEL_53.1(OUT0) R59.1
N$3443: PIXEL_53.2(OUT1) R60.1
N$3444: PIXEL_53.3(OUT2) R61.1
N$3445: CB14.2 RB14.2
N$3446: CB15.2 RB15.2
N$3447: CB16.1 RB16.2
N$5050: ENC_54.1(-R) R78.2
N$5051: ENC_54.2(-G) R80.2
N$5052: ENC_54.4(-B) R83.2
N$5053: PIXEL_54.1(OUT0) R78.1
N$5054: PIXEL_54.2(OUT1) R80.1
N$5055: PIXEL_54.3(OUT2) R83.1
N$5056: CB26.2 RB26.2
N$5057: CB27.2 RB27.2
N$5058: CB28.1 RB28.2
N$5599: ENC_55.1(-R) R100.2
N$5600: ENC_55.2(-G) R101.2
N$5601: ENC_55.4(-B) R109.2
N$5602: PIXEL_55.1(OUT0) R100.1
N$5603: PIXEL_55.2(OUT1) R101.1
N$5604: PIXEL_55.3(OUT2) R109.1
N$5605: CB35.2 RB35.2
N$5606: CB36.2 RB36.2
N$5607: CB37.1 RB37.2
N$5965: ENC_56.1(-R) R113.2
N$5966: ENC_56.2(-G) R114.2
N$5967: ENC_56.4(-B) R115.2
N$5968: PIXEL_56.1(OUT0) R113.1
N$5969: PIXEL_56.2(OUT1) R114.1
N$5970: PIXEL_56.3(OUT2) R115.1
N$5971: CB41.2 RB41.2
N$5972: CB42.2 RB42.2
N$5973: CB43.1 RB43.2
N$6327: PIXEL_52.1(OUT0) R125.1
N$6328: PIXEL_52.2(OUT1) R147.1
N$6329: PIXEL_52.3(OUT2) R148.1
N$6330: CB5.2 RB5.2
N$6331: ENC_57.1(-R) R126.2
N$6332: ENC_57.2(-G) R127.2
N$6333: ENC_57.4(-B) R128.2
N$6334: PIXEL_57.1(OUT0) R126.1
N$6335: PIXEL_57.2(OUT1) R127.1
N$6336: PIXEL_57.3(OUT2) R128.1
N$6337: CB47.2 RB47.2
N$6338: CB48.2 RB48.2
N$6339: CB49.1 RB49.2
N$6697: ENC_61.1(-R) R132.2
N$6698: ENC_61.2(-G) R133.2
N$6699: ENC_61.4(-B) R134.2
N$6700: PIXEL_61.1(OUT0) R132.1
N$6701: PIXEL_61.2(OUT1) R133.1
N$6702: PIXEL_61.3(OUT2) R134.1
N$6703: CB53.2 RB53.2
N$6704: CB54.2 RB54.2
N$6705: CB55.1 RB55.2
N$7063: ENC_62.1(-R) R138.2
N$7064: ENC_62.2(-G) R139.2
N$7065: ENC_62.4(-B) R140.2
N$7066: PIXEL_62.1(OUT0) R138.1
N$7067: PIXEL_62.2(OUT1) R139.1
N$7068: PIXEL_62.3(OUT2) R140.1
N$7069: CB59.2 RB59.2
N$7070: CB60.2 RB60.2
N$7071: CB61.1 RB61.2
N$7429: ENC_63.1(-R) R144.2
N$7430: ENC_63.2(-G) R145.2
N$7431: ENC_63.4(-B) R146.2
N$7432: PIXEL_63.1(OUT0) R144.1
N$7433: PIXEL_63.2(OUT1) R145.1
N$7434: PIXEL_63.3(OUT2) R146.1
N$7435: CB65.2 RB65.2
N$7436: CB66.2 RB66.2
N$7437: CB67.1 RB67.2
N$7612: LED4.1(R) R148.2
N$7613: LED4.4(B) R147.2
N$7614: LED4.3(G) R125.2
N$7795: ENC_64.1(-R) R150.2
N$7796: ENC_64.2(-G) R151.2
N$7797: ENC_64.4(-B) R152.2
N$7798: PIXEL_64.1(OUT0) R150.1
N$7799: PIXEL_64.2(OUT1) R151.1
N$7800: PIXEL_64.3(OUT2) R152.1
N$7801: CB71.2 RB71.2
N$7802: CB72.2 RB72.2
N$7803: CB73.1 RB73.2
N$8885: PIXEL_65.1(OUT0) R167.1
N$8886: PIXEL_65.2(OUT1) R174.1
N$8887: PIXEL_65.3(OUT2) R175.1
N$8888: CB44.2 RB44.2
N$8889: LED7.1(R) R175.2
N$8890: LED7.4(B) R174.2
N$8891: LED7.3(G) R167.2
PIXEL_48: PIXEL_61.6(SDI) ; also sheet 3
PIXEL_51: PIXEL_51.5(SDO) PIXEL_52.6(SDI)
PIXEL_52: PIXEL_52.5(SDO) PIXEL_53.6(SDI)
PIXEL_53: PIXEL_53.5(SDO) PIXEL_57.6(SDI)
PIXEL_54: PIXEL_54.5(SDO) ; also sheet 3
PIXEL_55: PIXEL_54.6(SDI) PIXEL_55.5(SDO)
PIXEL_56: PIXEL_55.6(SDI) PIXEL_56.5(SDO)
PIXEL_57: PIXEL_56.6(SDI) PIXEL_57.5(SDO)
PIXEL_61: PIXEL_61.5(SDO) PIXEL_62.6(SDI)
PIXEL_62: PIXEL_62.5(SDO) PIXEL_63.6(SDI)
PIXEL_63: PIXEL_63.5(SDO) PIXEL_64.6(SDI)
PIXEL_64: PIXEL_64.5(SDO) PIXEL_65.6(SDI)
RST: MCP_011.18(!RESET) MCP_100.18(!RESET) ; also sheet 1,2,3,5,6
SPI3_MOSI: PIXEL_51.6(SDI) ; also sheet 1,2
Unconnected: PIXEL_51.7(TEST) PIXEL_52.7(TEST) PIXEL_53.7(TEST) PIXEL_54.7(TEST) PIXEL_55.7(TEST) PIXEL_56.7(TEST) PIXEL_57.7(TEST) PIXEL_61.7(TEST) PIXEL_62.7(TEST) PIXEL_63.7(TEST) PIXEL_64.7(TEST) PIXEL_65.5(SDO) PIXEL_65.7(TEST)

### Notes on the sheet
- RGB ENCODER 55 | RGB ENCODER 57 | RGB ENCODER 64
- RGB ENCODER 54 | RGB ENCODER 56 | RGB ENCODER 63
- RGB ENCODER 53 | RGB ENCODER 62
- SWITCH RGB 65
- RGB ENCODER 51 | SWITCH RGB 52 | RGB ENCODER 61
- EG

## Sheet 5 of 8
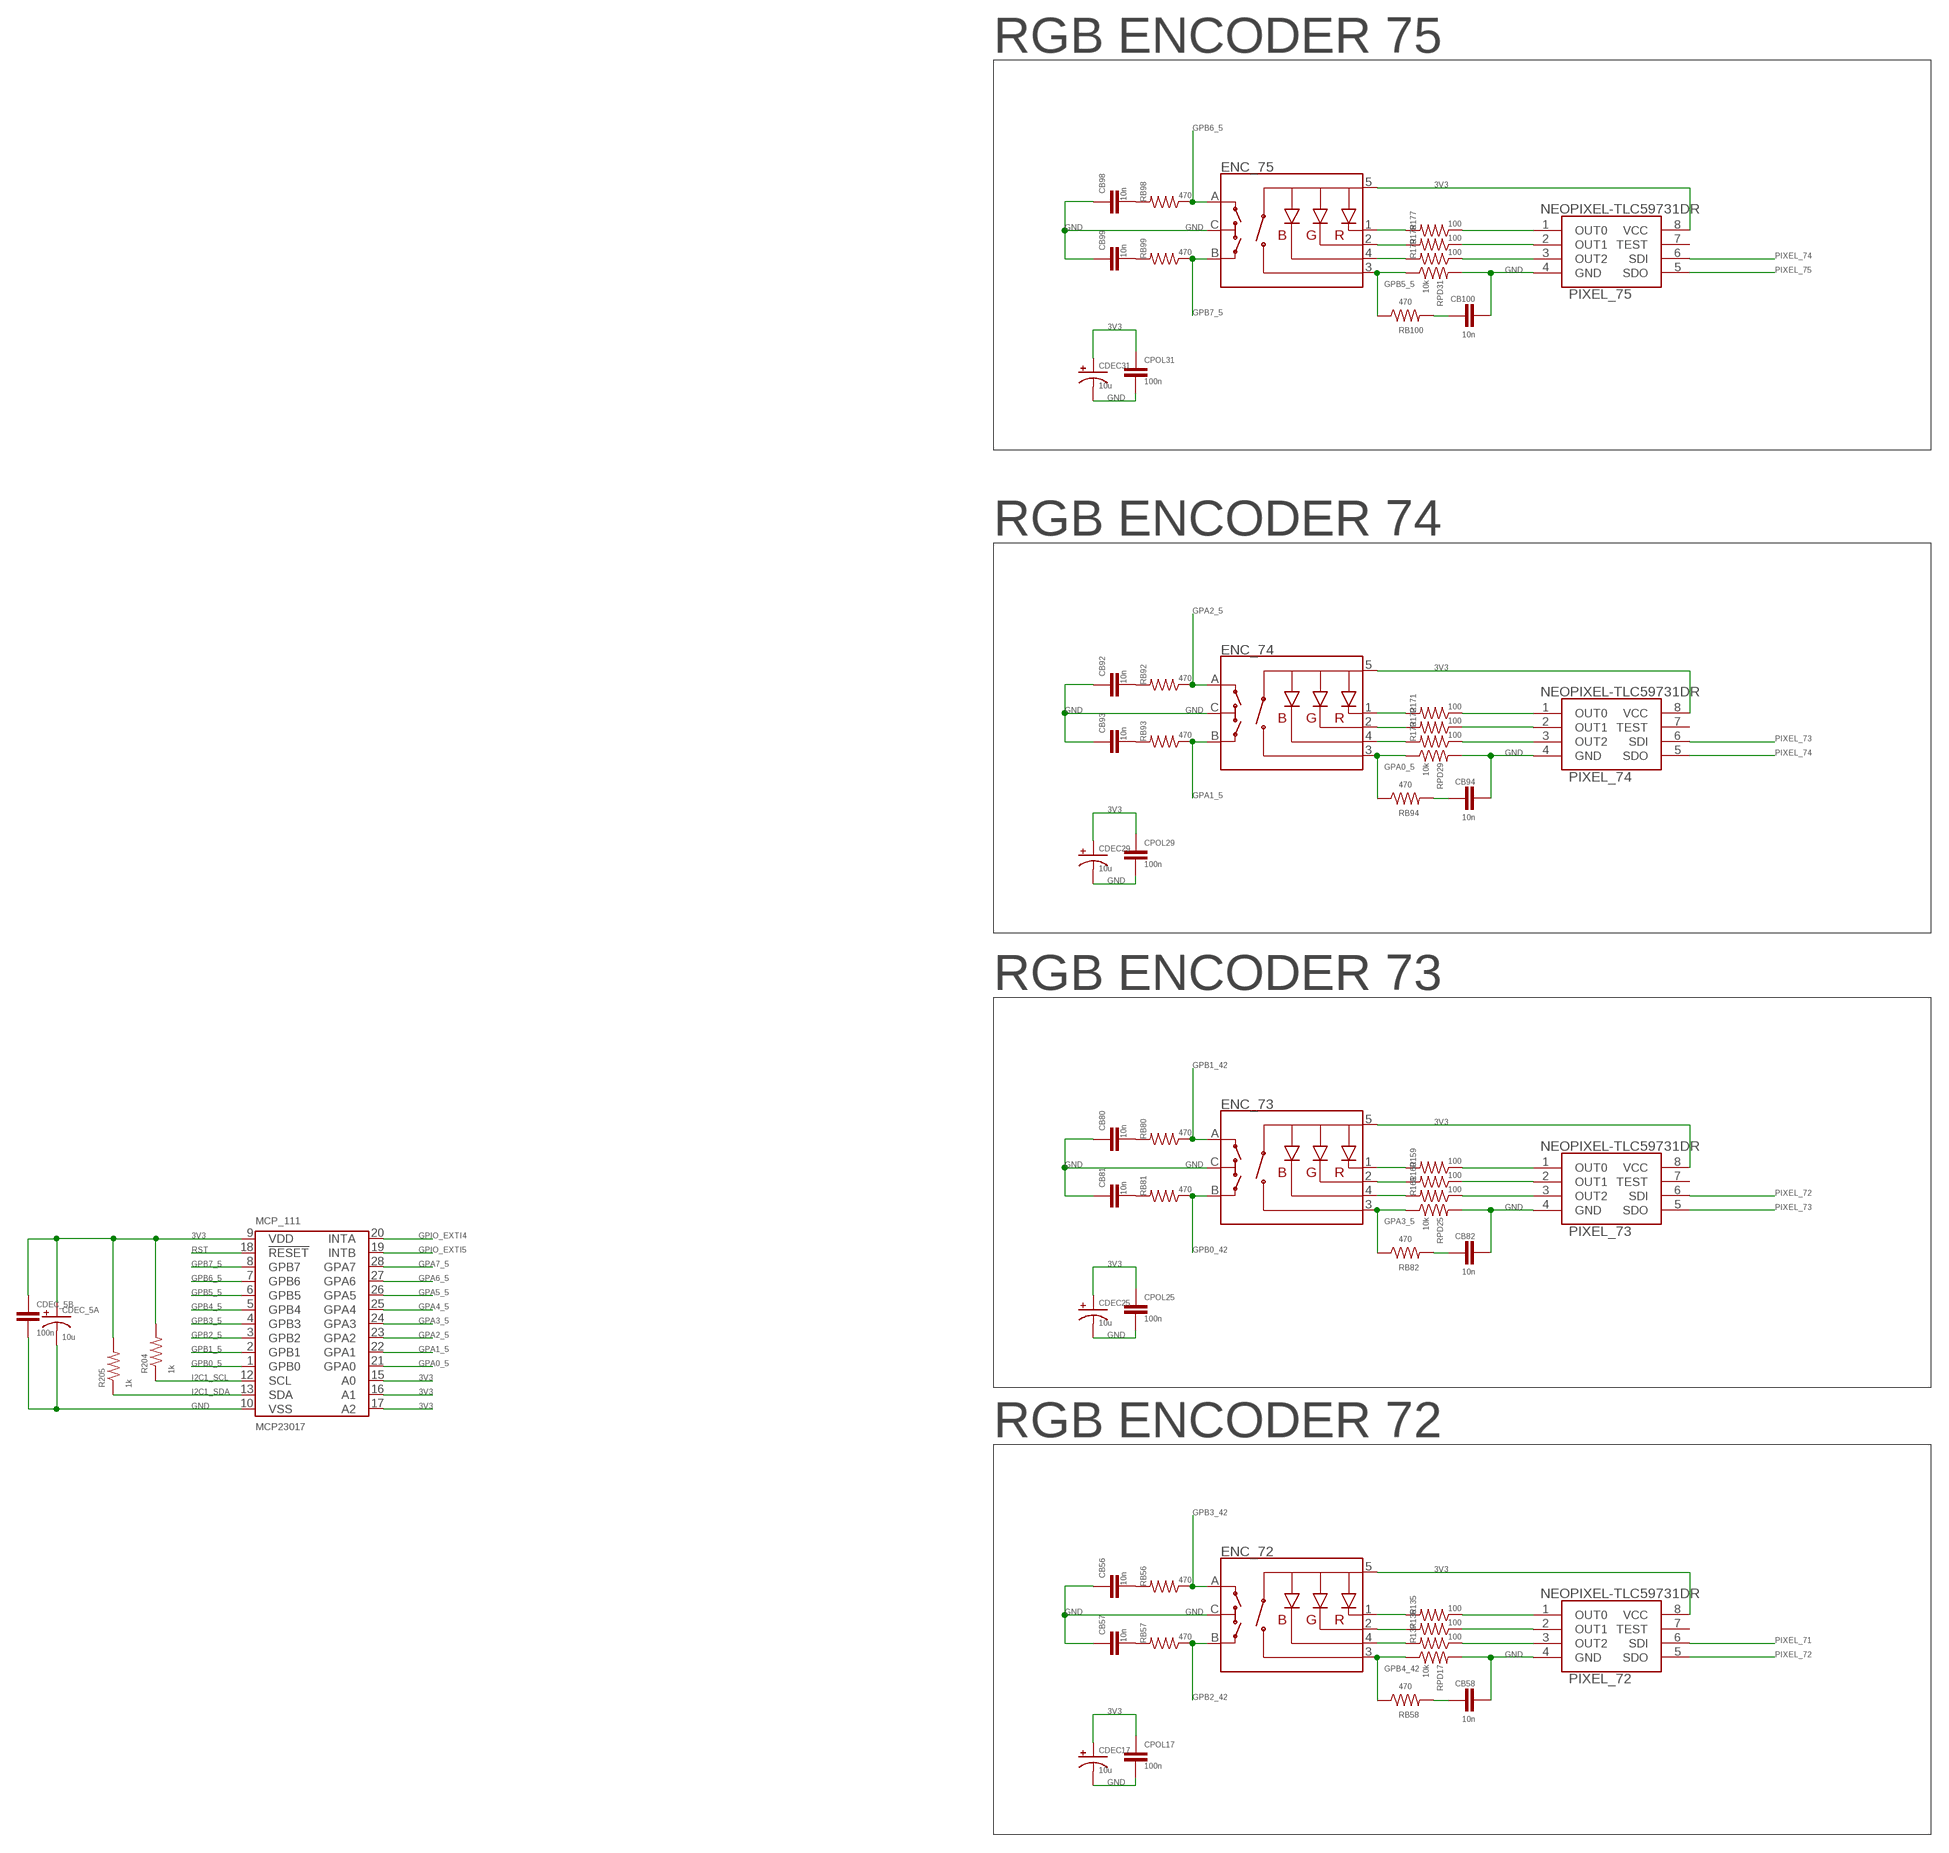
[diagram p10: schematic, sheet 5, part 1 of 2]
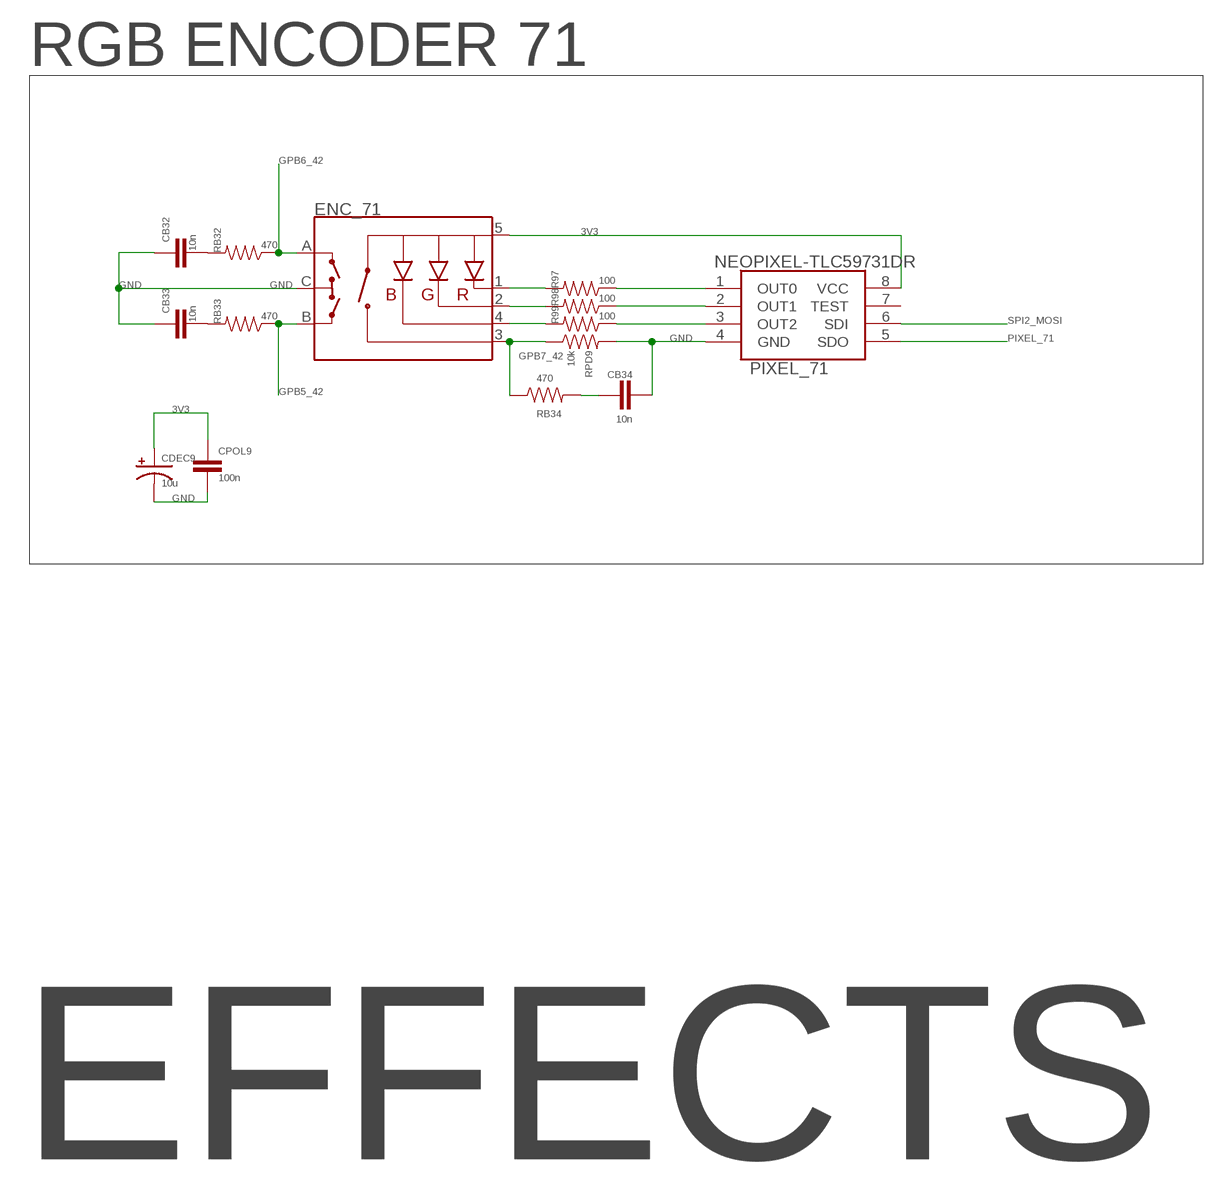
[diagram p11: schematic, sheet 5, part 2 of 2]

### Parts
CB32  10n  PASSIF-CAP-0805  [0805-CAP]
CB33  10n  PASSIF-CAP-0805  [0805-CAP]
CB34  10n  PASSIF-CAP-0805  [0805-CAP]
CB56  10n  PASSIF-CAP-0805  [0805-CAP]
CB57  10n  PASSIF-CAP-0805  [0805-CAP]
CB58  10n  PASSIF-CAP-0805  [0805-CAP]
CB80  10n  PASSIF-CAP-0805  [0805-CAP]
CB81  10n  PASSIF-CAP-0805  [0805-CAP]
CB82  10n  PASSIF-CAP-0805  [0805-CAP]
CB92  10n  PASSIF-CAP-0805  [0805-CAP]
CB93  10n  PASSIF-CAP-0805  [0805-CAP]
CB94  10n  PASSIF-CAP-0805  [0805-CAP]
CB98  10n  PASSIF-CAP-0805  [0805-CAP]
CB99  10n  PASSIF-CAP-0805  [0805-CAP]
CB100  10n  PASSIF-CAP-0805  [0805-CAP]
CDEC9  10u  PASSIF-CPOL-US2917  [CPOL2917]
CDEC17  10u  PASSIF-CPOL-US2917  [CPOL2917]
CDEC25  10u  PASSIF-CPOL-US2917  [CPOL2917]
CDEC29  10u  PASSIF-CPOL-US2917  [CPOL2917]
CDEC31  10u  PASSIF-CPOL-US2917  [CPOL2917]
CDEC_5A  10u  PASSIF-CPOL-US2917  [CPOL2917]
CDEC_5B  100n  PASSIF-CAP-0805  [0805-CAP]
CPOL9  100n  PASSIF-CAP-0805  [0805-CAP]
CPOL17  100n  PASSIF-CAP-0805  [0805-CAP]
CPOL25  100n  PASSIF-CAP-0805  [0805-CAP]
CPOL29  100n  PASSIF-CAP-0805  [0805-CAP]
CPOL31  100n  PASSIF-CAP-0805  [0805-CAP]
ENC_71  ENCODER-RGB-SWITCH-NO_NUT  [ENCODER_LED_3]
ENC_72  ENCODER-RGB-SWITCH-NO_NUT  [ENCODER_LED_3]
ENC_73  ENCODER-RGB-SWITCH-NO_NUT  [ENCODER_LED_3]
ENC_74  ENCODER-RGB-SWITCH-NO_NUT  [ENCODER_LED_3]
ENC_75  ENCODER-RGB-SWITCH-NO_NUT  [ENCODER_LED_3]
MCP_111  MCP23017  [SOIC-28]
PIXEL_71  NEOPIXEL-TLC59731DR  [SOIC127P600X175-8N]
PIXEL_72  NEOPIXEL-TLC59731DR  [SOIC127P600X175-8N]
PIXEL_73  NEOPIXEL-TLC59731DR  [SOIC127P600X175-8N]
PIXEL_74  NEOPIXEL-TLC59731DR  [SOIC127P600X175-8N]
PIXEL_75  NEOPIXEL-TLC59731DR  [SOIC127P600X175-8N]
R97  100  PASSIF-RESISTOR-1206  [1206]
R98  100  PASSIF-RESISTOR-1206  [1206]
R99  100  PASSIF-RESISTOR-1206  [1206]
R135  100  PASSIF-RESISTOR-1206  [1206]
R136  100  PASSIF-RESISTOR-1206  [1206]
R137  100  PASSIF-RESISTOR-1206  [1206]
R159  100  PASSIF-RESISTOR-1206  [1206]
R160  100  PASSIF-RESISTOR-1206  [1206]
R161  100  PASSIF-RESISTOR-1206  [1206]
R171  100  PASSIF-RESISTOR-1206  [1206]
R172  100  PASSIF-RESISTOR-1206  [1206]
R173  100  PASSIF-RESISTOR-1206  [1206]
R177  100  PASSIF-RESISTOR-1206  [1206]
R178  100  PASSIF-RESISTOR-1206  [1206]
R179  100  PASSIF-RESISTOR-1206  [1206]
R204  1k  R-US_R0805  [R0805]
R205  1k  R-US_R0805  [R0805]
RB32  470  PASSIF-RESISTOR-1206  [1206]
RB33  470  PASSIF-RESISTOR-1206  [1206]
RB34  470  PASSIF-RESISTOR-1206  [1206]
RB56  470  PASSIF-RESISTOR-1206  [1206]
RB57  470  PASSIF-RESISTOR-1206  [1206]
RB58  470  PASSIF-RESISTOR-1206  [1206]
RB80  470  PASSIF-RESISTOR-1206  [1206]
RB81  470  PASSIF-RESISTOR-1206  [1206]
RB82  470  PASSIF-RESISTOR-1206  [1206]
RB92  470  PASSIF-RESISTOR-1206  [1206]
RB93  470  PASSIF-RESISTOR-1206  [1206]
RB94  470  PASSIF-RESISTOR-1206  [1206]
RB98  470  PASSIF-RESISTOR-1206  [1206]
RB99  470  PASSIF-RESISTOR-1206  [1206]
RB100  470  PASSIF-RESISTOR-1206  [1206]
RPD9  10k  PASSIF-RESISTOR-1206  [1206]
RPD17  10k  PASSIF-RESISTOR-1206  [1206]
RPD25  10k  PASSIF-RESISTOR-1206  [1206]
RPD29  10k  PASSIF-RESISTOR-1206  [1206]
RPD31  10k  PASSIF-RESISTOR-1206  [1206]

### Nets
3V3: CDEC9.+ CDEC17.+ CDEC25.+ CDEC29.+ CDEC31.+ CDEC_5A.+ CDEC_5B.1 CPOL9.1 CPOL17.1 CPOL25.1 CPOL29.1 CPOL31.1 ENC_71.5(+) ENC_72.5(+) ENC_73.5(+) ENC_74.5(+) ENC_75.5(+) MCP_111.9(VDD) MCP_111.15(A0) MCP_111.16(A1) MCP_111.17(A2) PIXEL_71.8(VCC) PIXEL_72.8(VCC) PIXEL_73.8(VCC) PIXEL_74.8(VCC) PIXEL_75.8(VCC) R204.2 R205.2 ; also sheet 1,2,3,4,6,7
GND: CB32.1 CB33.1 CB34.2 CB56.1 CB57.1 CB58.2 CB80.1 CB81.1 CB82.2 CB92.1 CB93.1 CB94.2 CB98.1 CB99.1 CB100.2 CDEC9.- CDEC17.- CDEC25.- CDEC29.- CDEC31.- CDEC_5A.- CDEC_5B.2 CPOL9.2 CPOL17.2 CPOL25.2 CPOL29.2 CPOL31.2 ENC_71.C ENC_72.C ENC_73.C ENC_74.C ENC_75.C MCP_111.10(VSS) PIXEL_71.4(GND) PIXEL_72.4(GND) PIXEL_73.4(GND) PIXEL_74.4(GND) PIXEL_75.4(GND) RPD9.2 RPD17.2 RPD25.2 RPD29.2 RPD31.2 ; also sheet 1,2,3,4,6,7
GPA0_5: ENC_74.3(SW) MCP_111.21(GPA0) RB94.1 RPD29.1
GPA1_5: ENC_74.B MCP_111.22(GPA1) RB93.1
GPA2_5: ENC_74.A MCP_111.23(GPA2) RB92.1
GPA3_5: ENC_73.3(SW) MCP_111.24(GPA3) RB82.1 RPD25.1
GPA4_5: MCP_111.25(GPA4) ; also sheet 6
GPA5_5: MCP_111.26(GPA5) ; also sheet 6
GPA6_5: MCP_111.27(GPA6) ; also sheet 6
GPA7_5: MCP_111.28(GPA7) ; also sheet 6
GPB0_5: MCP_111.1(GPB0) ; also sheet 6
GPB0_42: ENC_73.B RB81.1 ; also sheet 6
GPB1_5: MCP_111.2(GPB1) ; also sheet 6
GPB1_42: ENC_73.A RB80.1 ; also sheet 6
GPB2_5: MCP_111.3(GPB2) ; also sheet 6
GPB2_42: ENC_72.B RB57.1 ; also sheet 6
GPB3_5: MCP_111.4(GPB3) ; also sheet 6
GPB3_42: ENC_72.A RB56.1 ; also sheet 6
GPB4_5: MCP_111.5(GPB4) ; also sheet 6
GPB4_42: ENC_72.3(SW) RB58.1 RPD17.1 ; also sheet 6
GPB5_5: ENC_75.3(SW) MCP_111.6(GPB5) RB100.1 RPD31.1
GPB5_42: ENC_71.B RB33.1 ; also sheet 6
GPB6_5: ENC_75.A MCP_111.7(GPB6) RB98.1
GPB6_42: ENC_71.A RB32.1 ; also sheet 6
GPB7_5: ENC_75.B MCP_111.8(GPB7) RB99.1
GPB7_42: ENC_71.3(SW) RB34.1 RPD9.1 ; also sheet 6
GPIO_EXTI4: MCP_111.20(INTA) ; also sheet 1
GPIO_EXTI5: MCP_111.19(INTB) ; also sheet 1
I2C1_SCL: MCP_111.12(SCL) R204.1 ; also sheet 1,6
I2C1_SDA: MCP_111.13(SDA) R205.1 ; also sheet 1,6
N$5416: ENC_71.1(-R) R97.2
N$5417: ENC_71.2(-G) R98.2
N$5418: ENC_71.4(-B) R99.2
N$5419: PIXEL_71.1(OUT0) R97.1
N$5420: PIXEL_71.2(OUT1) R98.1
N$5421: PIXEL_71.3(OUT2) R99.1
N$5422: CB32.2 RB32.2
N$5423: CB33.2 RB33.2
N$5424: CB34.1 RB34.2
N$6880: ENC_72.1(-R) R135.2
N$6881: ENC_72.2(-G) R136.2
N$6882: ENC_72.4(-B) R137.2
N$6883: PIXEL_72.1(OUT0) R135.1
N$6884: PIXEL_72.2(OUT1) R136.1
N$6885: PIXEL_72.3(OUT2) R137.1
N$6886: CB56.2 RB56.2
N$6887: CB57.2 RB57.2
N$6888: CB58.1 RB58.2
N$8344: ENC_73.1(-R) R159.2
N$8345: ENC_73.2(-G) R160.2
N$8346: ENC_73.4(-B) R161.2
N$8347: PIXEL_73.1(OUT0) R159.1
N$8348: PIXEL_73.2(OUT1) R160.1
N$8349: PIXEL_73.3(OUT2) R161.1
N$8350: CB80.2 RB80.2
N$8351: CB81.2 RB81.2
N$8352: CB82.1 RB82.2
N$9076: ENC_74.1(-R) R171.2
N$9077: ENC_74.2(-G) R172.2
N$9078: ENC_74.4(-B) R173.2
N$9079: PIXEL_74.1(OUT0) R171.1
N$9080: PIXEL_74.2(OUT1) R172.1
N$9081: PIXEL_74.3(OUT2) R173.1
N$9082: CB92.2 RB92.2
N$9083: CB93.2 RB93.2
N$9084: CB94.1 RB94.2
N$9442: ENC_75.1(-R) R177.2
N$9443: ENC_75.2(-G) R178.2
N$9444: ENC_75.4(-B) R179.2
N$9445: PIXEL_75.1(OUT0) R177.1
N$9446: PIXEL_75.2(OUT1) R178.1
N$9447: PIXEL_75.3(OUT2) R179.1
N$9448: CB98.2 RB98.2
N$9449: CB99.2 RB99.2
N$9450: CB100.1 RB100.2
PIXEL_71: PIXEL_71.5(SDO) PIXEL_72.6(SDI)
PIXEL_72: PIXEL_72.5(SDO) PIXEL_73.6(SDI)
PIXEL_73: PIXEL_73.5(SDO) PIXEL_74.6(SDI)
PIXEL_74: PIXEL_74.5(SDO) PIXEL_75.6(SDI)
PIXEL_75: PIXEL_75.5(SDO) ; also sheet 6
RST: MCP_111.18(!RESET) ; also sheet 1,2,3,4,6
SPI2_MOSI: PIXEL_71.6(SDI) ; also sheet 1
Unconnected: PIXEL_71.7(TEST) PIXEL_72.7(TEST) PIXEL_73.7(TEST) PIXEL_74.7(TEST) PIXEL_75.7(TEST)

### Notes on the sheet
- RGB ENCODER 75
- RGB ENCODER 74
- RGB ENCODER 73
- RGB ENCODER 72
- RGB ENCODER 71
- EFFECTS